# EAGLE design synth-a-phone-v1.1 (EAGLE 5.11)
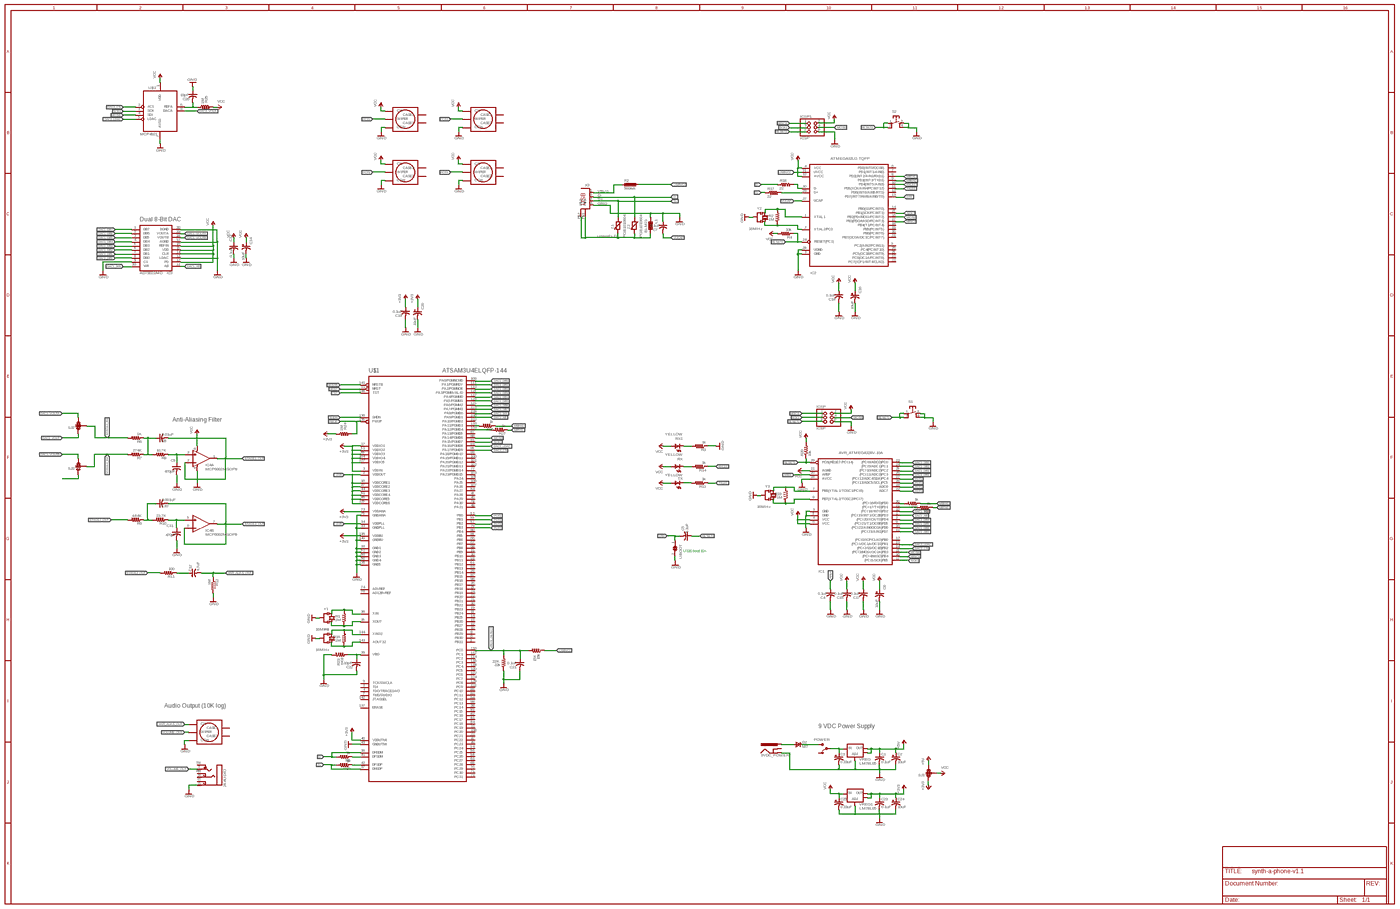
[diagram p0: schematic, sheet 1, overview]
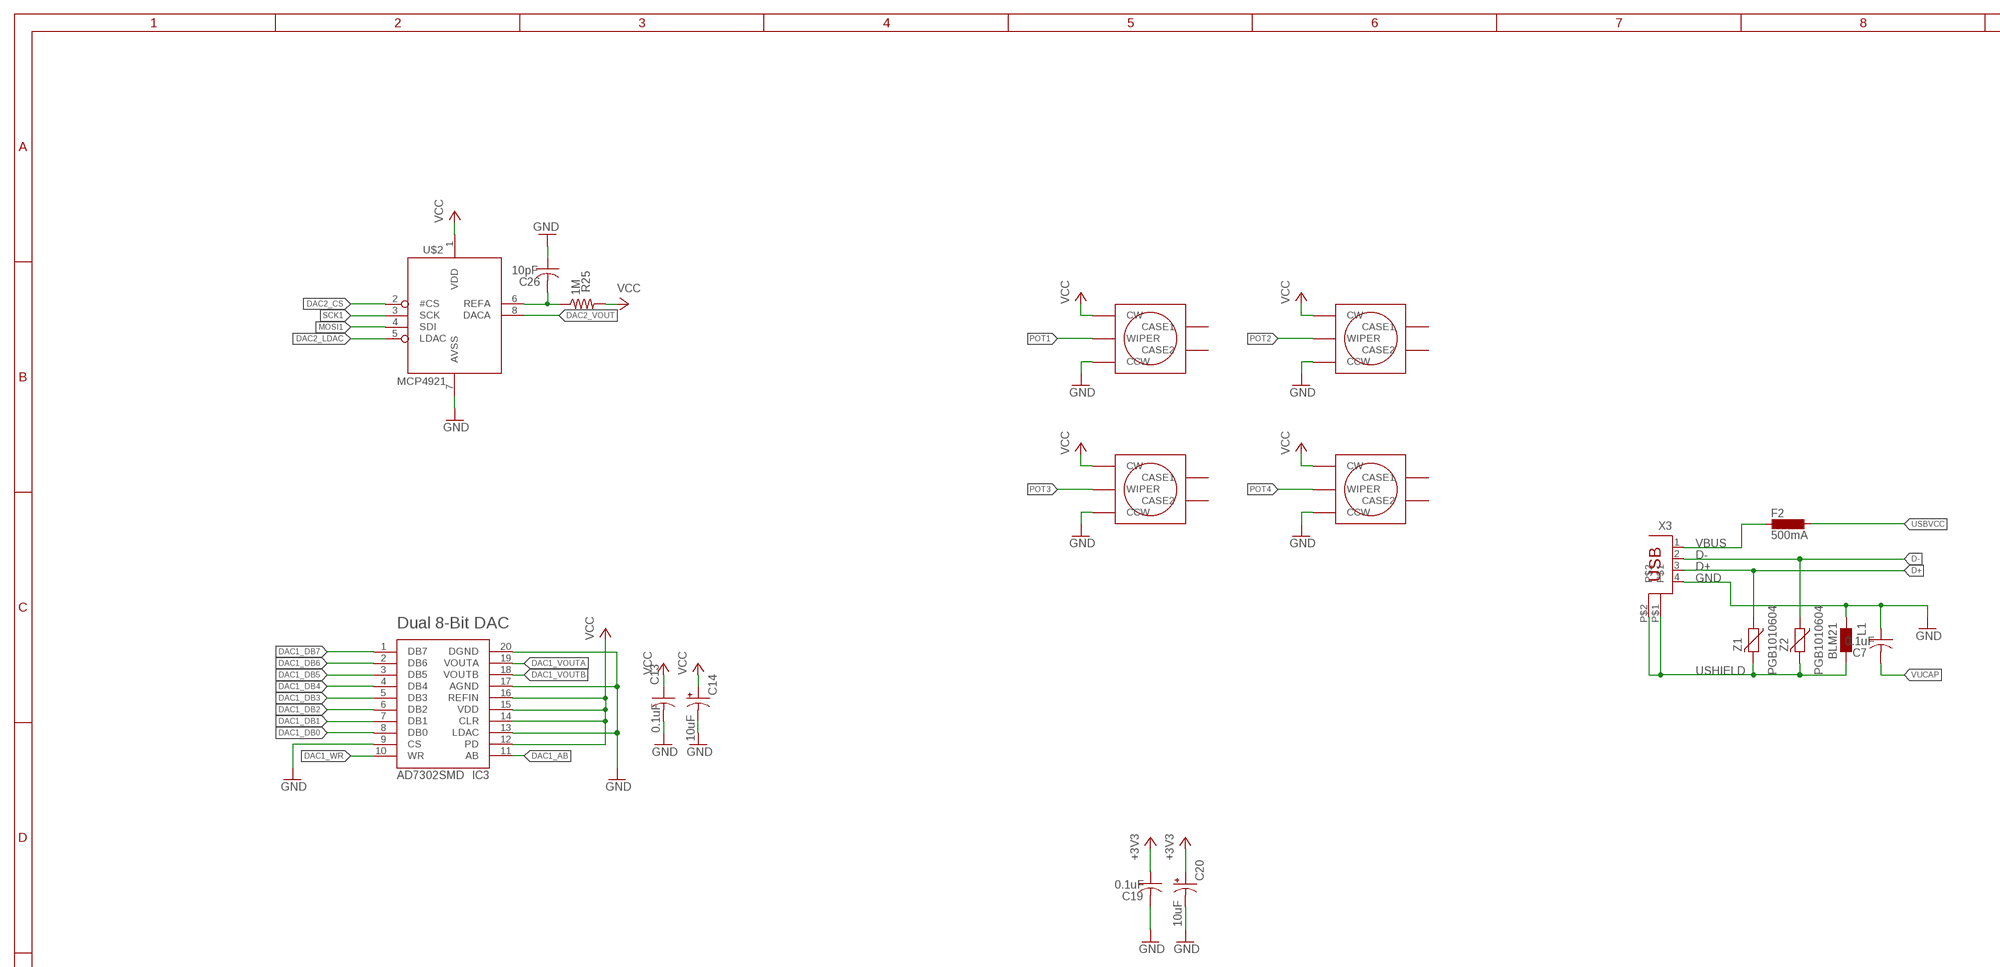
[diagram p1: schematic, sheet 1, part 1 of 4]
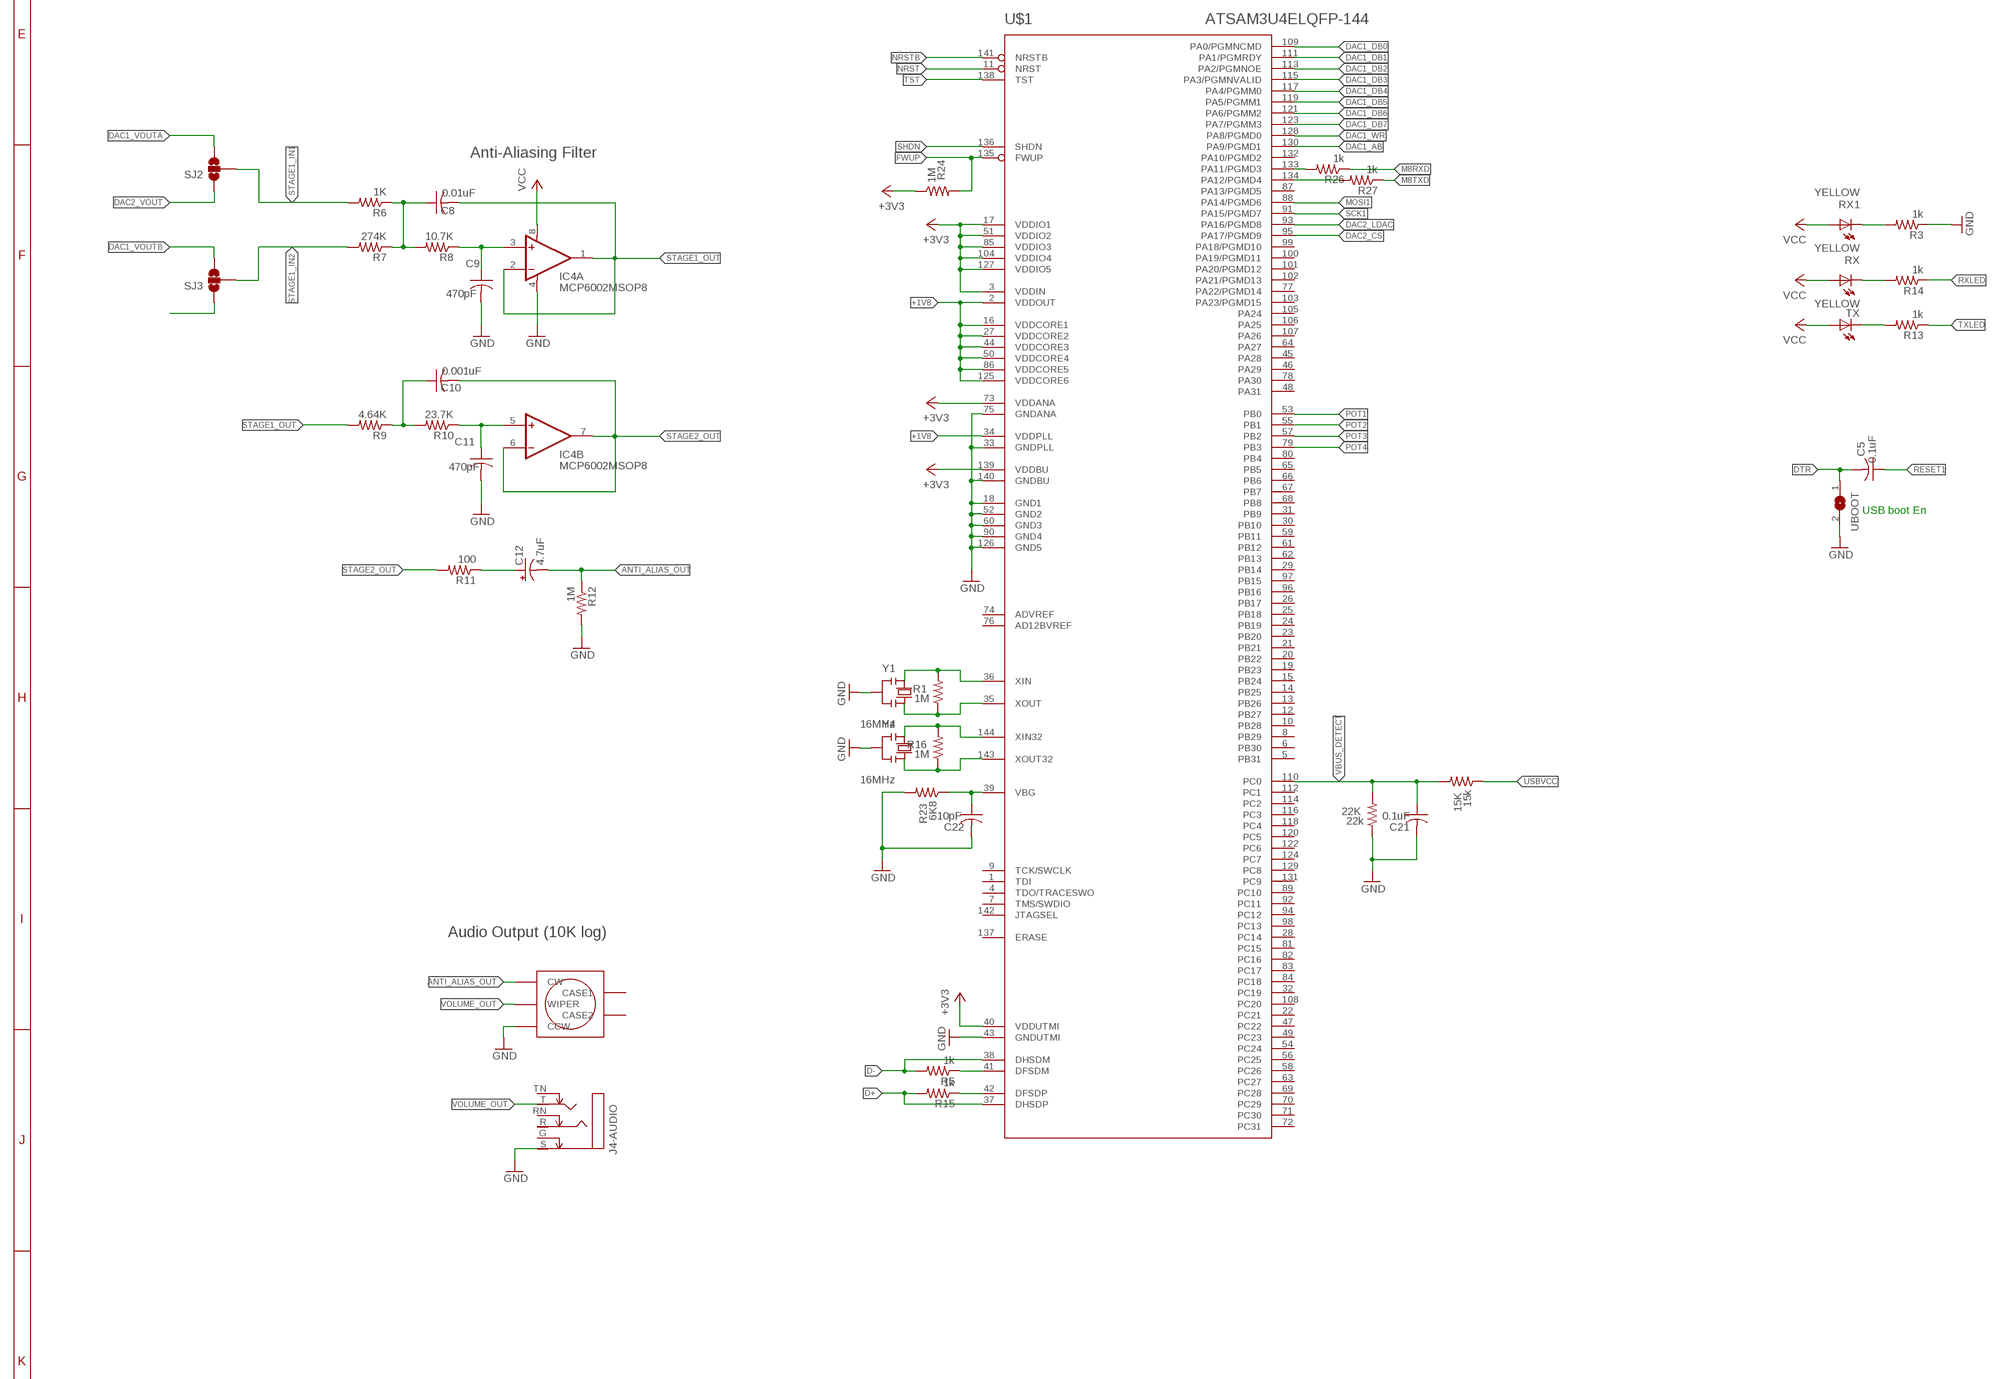
[diagram p2: schematic, sheet 1, part 2 of 4]
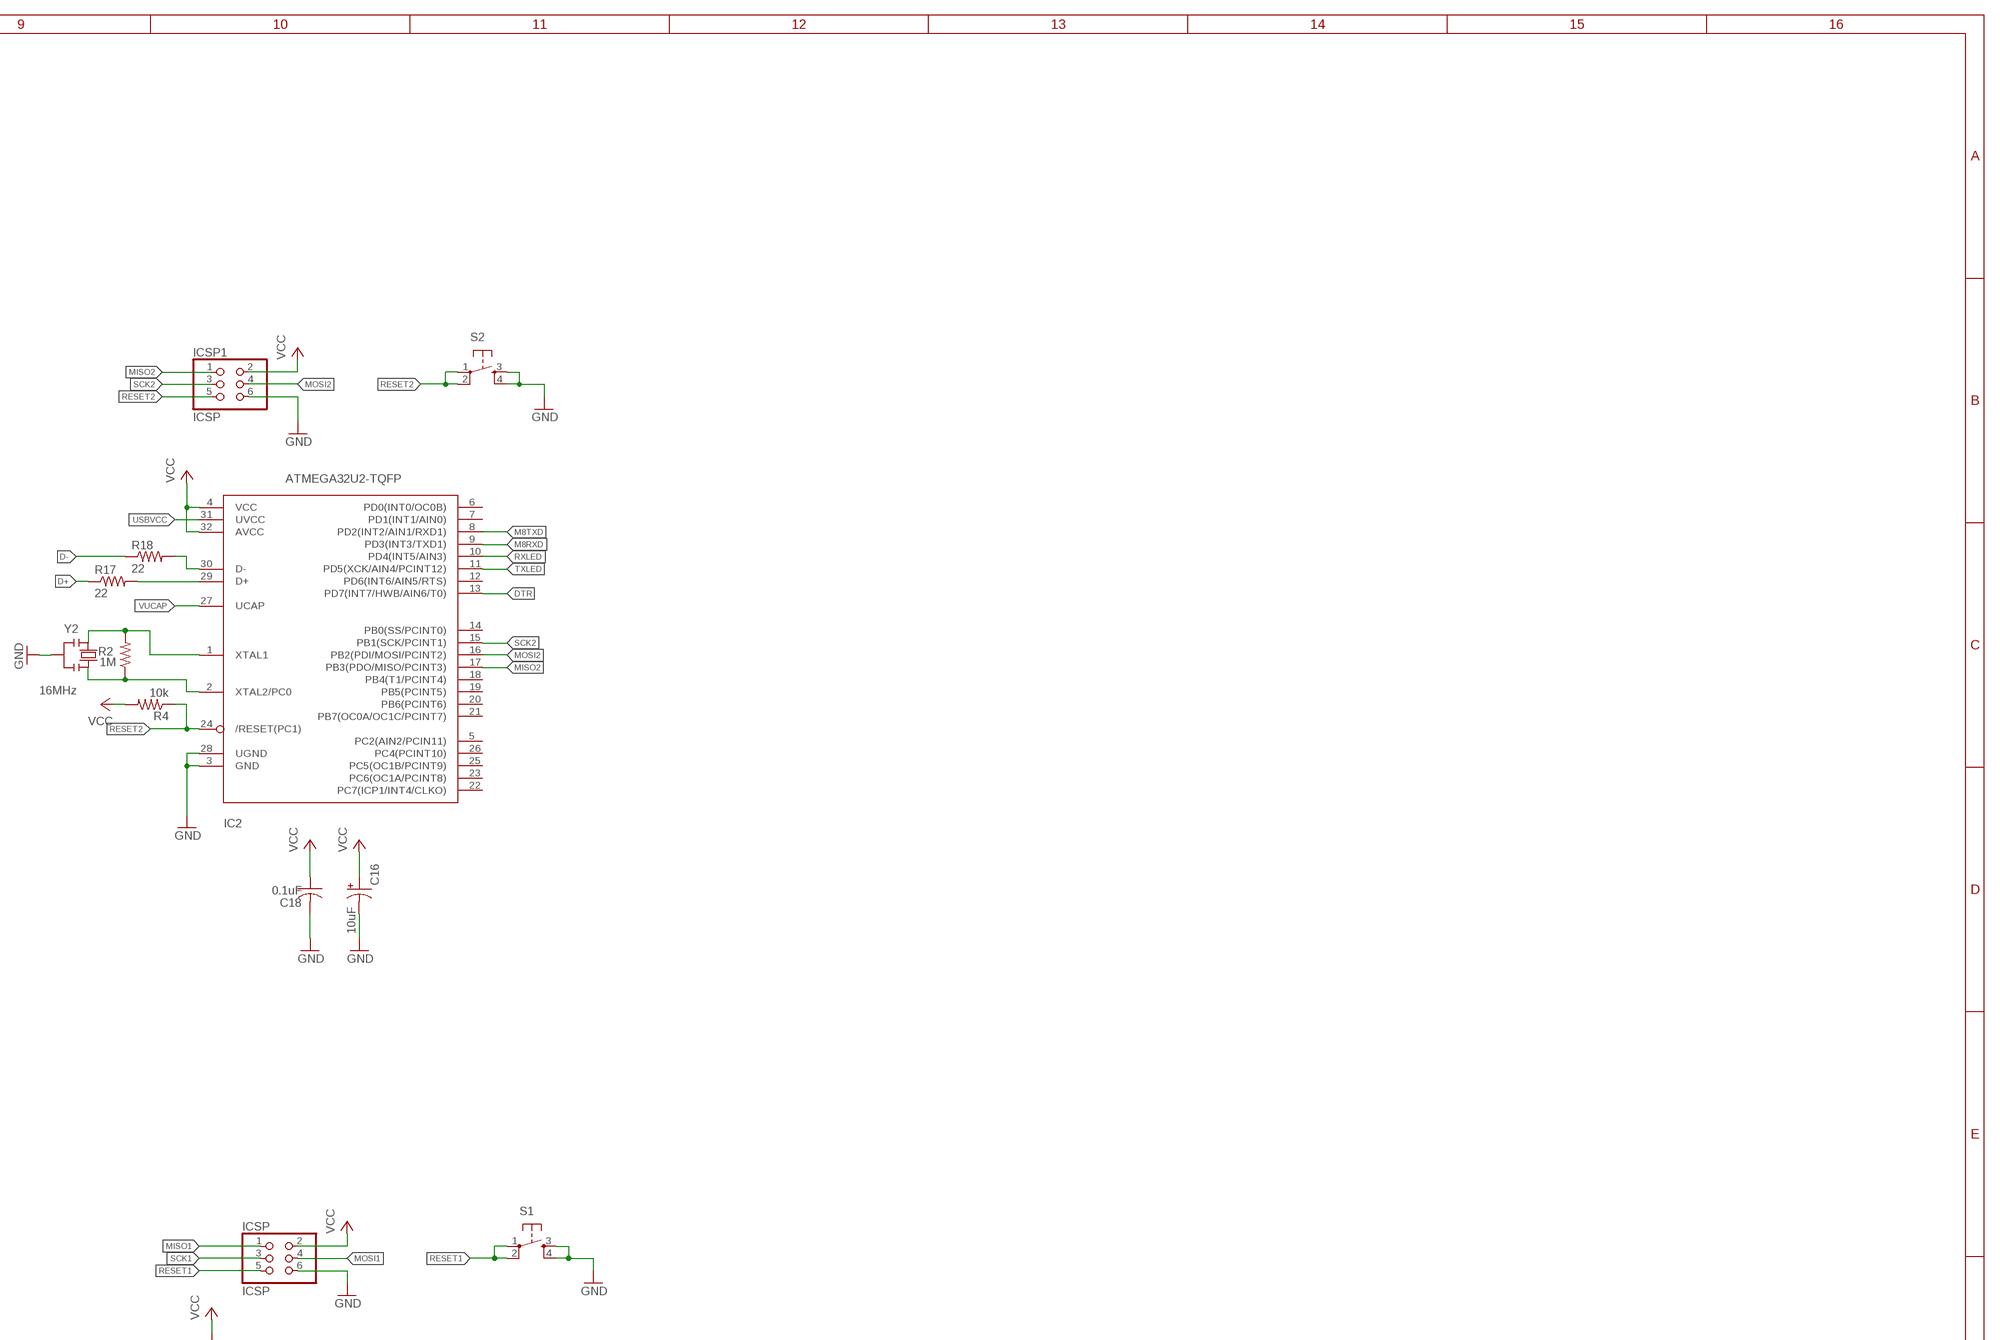
[diagram p3: schematic, sheet 1, part 3 of 4]
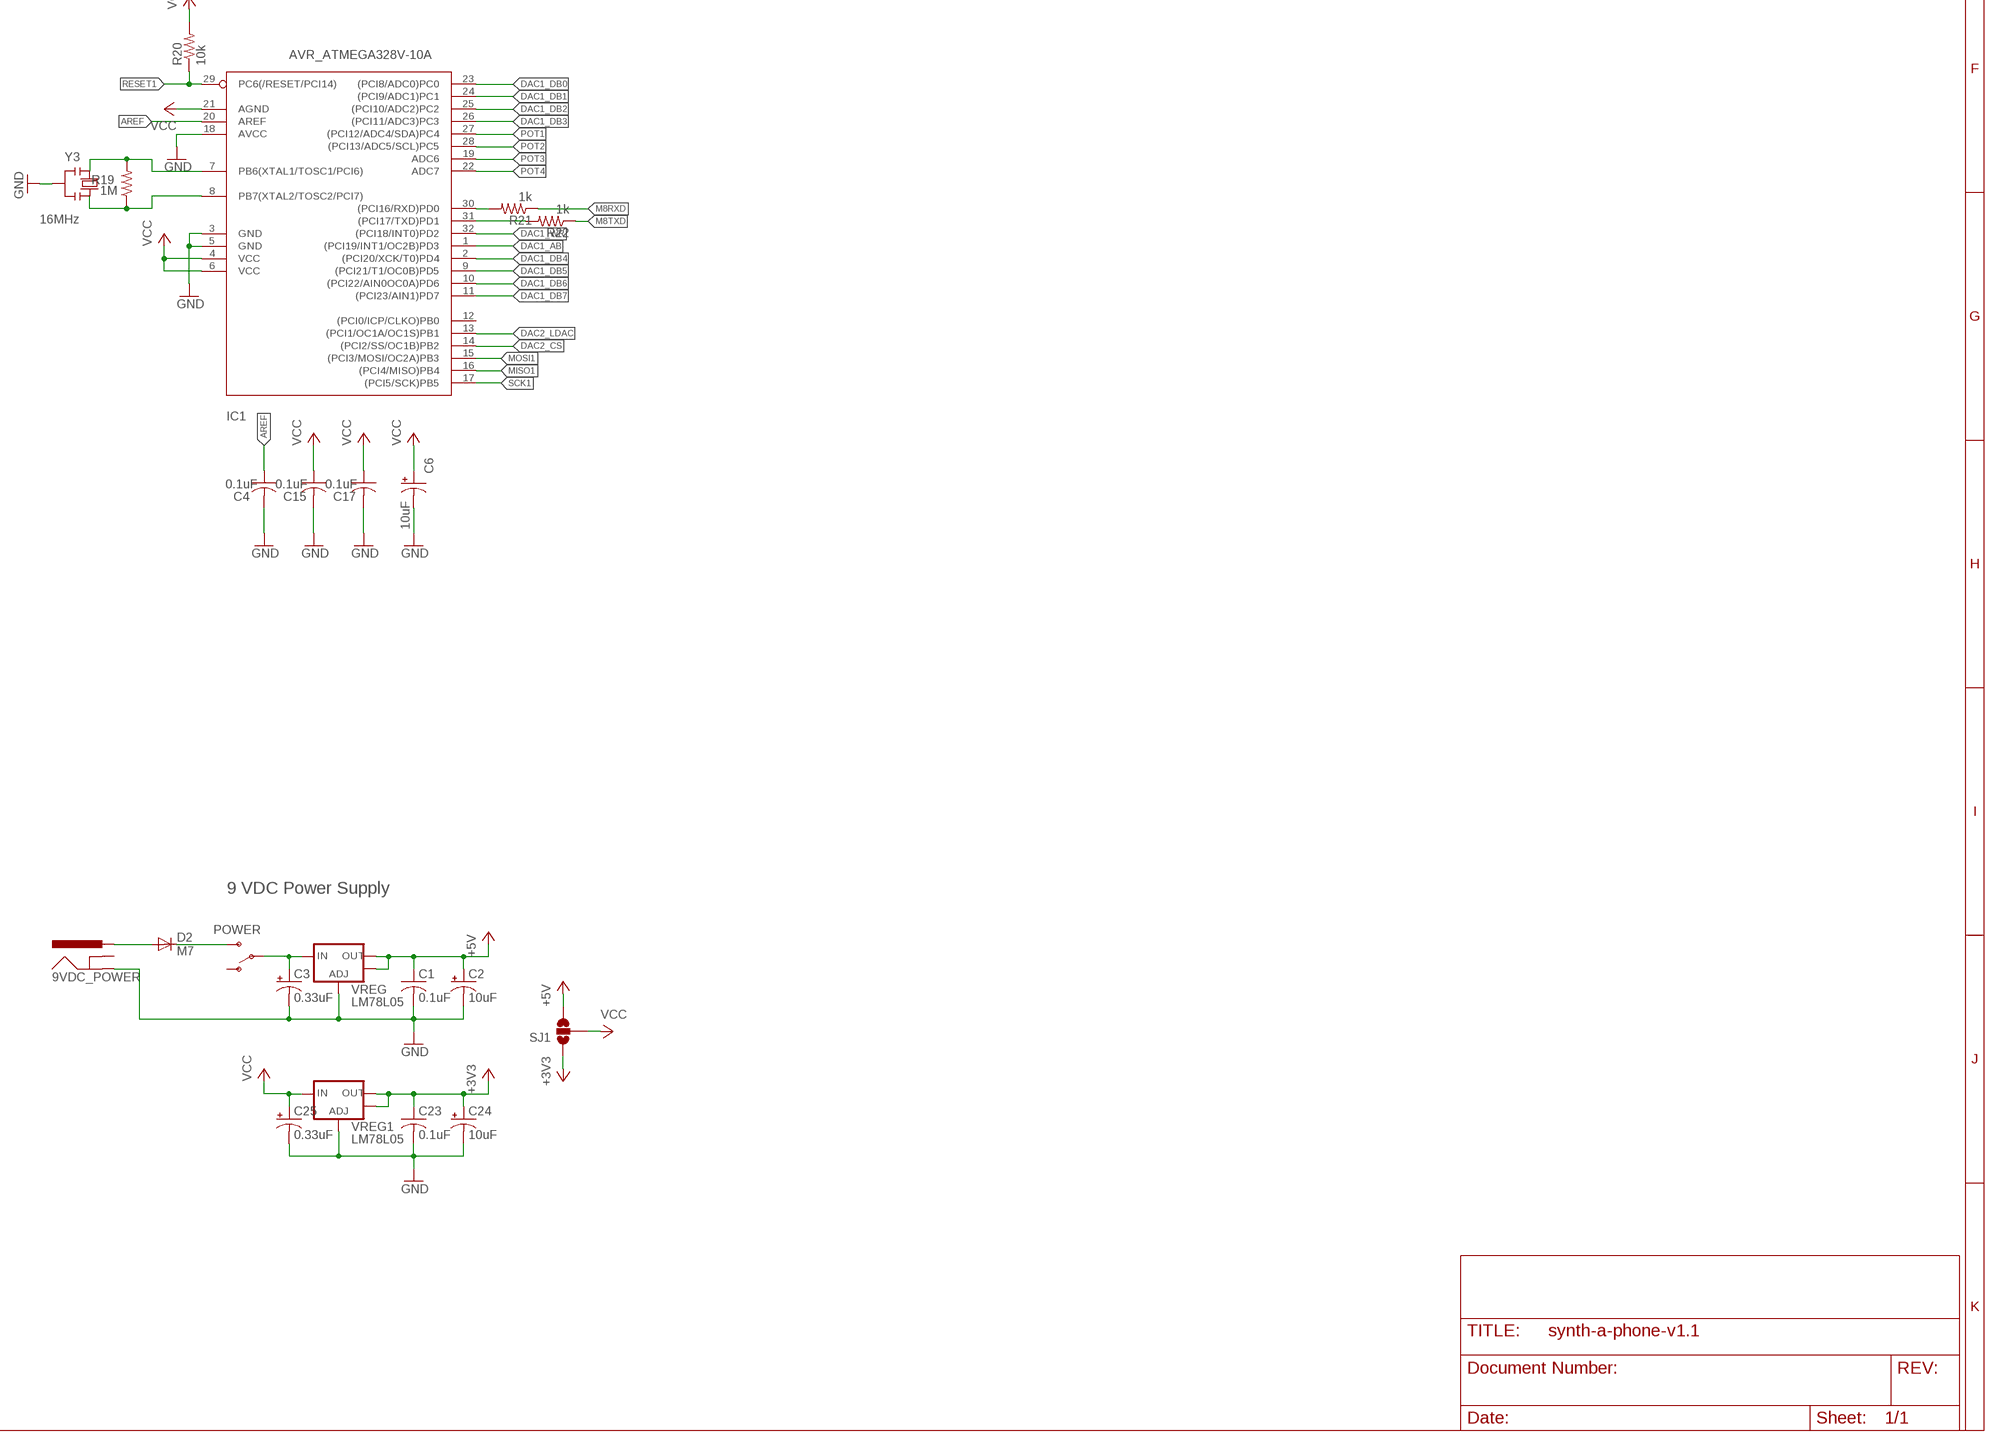
[diagram p4: schematic, sheet 1, part 4 of 4]

## Parts
9VDC_POWER  POWER_JACKPTH  [POWER_JACK_PTH]
15K  15k  R-US_R0603  [R0603]
22K  22k  R-US_R0603  [R0603]
C1  0.1uF  C-USC0603  [C0603]
C2  10uF  CPOL-USSMCA  [SMC_A]
C3  0.33uF  CPOL-USSMCA  [SMC_A]
C4  0.1uF  C-USC0603  [C0603]
C5  0.1uF  C-USC0603  [C0603]
C6  10uF  CPOL-USSMCA  [SMC_A]
C7  0.1uF  C-USC0603  [C0603]
C8  0.01uF  C-USC0603  [C0603]
C9  470pF  C-USC0603  [C0603]
C10  0.001uF  C-USC0603  [C0603]
C11  470pF  C-USC0603  [C0603]
C12  4.7uF  CPOL-USSMCA  [SMC_A]
C13  0.1uF  C-USC0603  [C0603]
C14  10uF  CPOL-USSMCA  [SMC_A]
C15  0.1uF  C-USC0603  [C0603]
C16  10uF  CPOL-USSMCA  [SMC_A]
C17  0.1uF  C-USC0603  [C0603]
C18  0.1uF  C-USC0603  [C0603]
C19  0.1uF  C-USC0603  [C0603]
C20  10uF  CPOL-USSMCA  [SMC_A]
C21  0.1uF  C-USC0603  [C0603]
C22  10pF  C-USC0603  [C0603]
C23  0.1uF  C-USC0603  [C0603]
C24  10uF  CPOL-USSMCA  [SMC_A]
C25  0.33uF  CPOL-USSMCA  [SMC_A]
C26  10pF  C-USC0603  [C0603]
D2  M7  DIODE-SMB  [SMB]
F2  500mA  L-EUL1812  [L1812]
IC1  AVR_ATMEGA328V-10A  [AVR_TQFP32-08]
IC2  ATMEGA32U2-TQFP  [TQFP32-08]
IC3  AD7302SMD  [TSSOP20]
IC4  MCP6002MSOP8  [MSOP8]
ICSP  ICSP  PINHD-2X3  [2X03]
ICSP1  ICSP  PINHD-2X3  [2X03]
J4-AUDIO  STEREOSWL  [NRJ6HF-1]
L1  BLM21  WE-CBF_0805  [0805]
POWER  SPST  SWITCH-SPSTPTH  [SWITCH-SPDT]
R1  1M  R-US_R0603  [R0603]
R2  1M  R-US_R0603  [R0603]
R3  1k  R-US_R0603  [R0603]
R4  10k  R-US_R0603  [R0603]
R5  1k  R-US_R0603  [R0603]
R6  1K  R-US_R0603  [R0603]
R7  274K  R-US_R0603  [R0603]
R8  10.7K  R-US_R0603  [R0603]
R9  4.64K  R-US_R0603  [R0603]
R10  23.7K  R-US_R0603  [R0603]
R11  100  R-US_R0603  [R0603]
R12  1M  R-US_R0603  [R0603]
R13  1k  R-US_R0603  [R0603]
R14  1k  R-US_R0603  [R0603]
R15  1k  R-US_R0603  [R0603]
R16  1M  R-US_R0603  [R0603]
R17  22  R-US_R0603  [R0603]
R18  22  R-US_R0603  [R0603]
R19  1M  R-US_R0603  [R0603]
R20  10k  R-US_R0603  [R0603]
R21  1k  R-US_R0603  [R0603]
R22  1k  R-US_R0603  [R0603]
R23  6K8  R-US_R0603  [R0603]
R24  1M  R-US_R0603  [R0603]
R25  1M  R-US_R0603  [R0603]
R26  1k  R-US_R0603  [R0603]
R27  1k  R-US_R0603  [R0603]
RX  YELLOW  LEDCHIP-LED0805  [CHIP-LED0805]
RX1  YELLOW  LEDCHIP-LED0805  [CHIP-LED0805]
S1  TAC_SWITCHPTH  [TACTILE-PTH]
S2  TAC_SWITCHPTH  [TACTILE-PTH]
SJ1  SOLDERJUMPER_2WAYS  [SJ_3]
SJ2  SOLDERJUMPER_2WAYS  [SJ_3]
SJ3  SOLDERJUMPER_2WAYS  [SJ_3]
TX  YELLOW  LEDCHIP-LED0805  [CHIP-LED0805]
U$1  ATSAM3U4ELQFP-144  [SQFP-S-20X20-144]
U$2  MCP4921MSOP8  [MSOP8]
UBOOT  SJ  [SJ]
VOLUME  Volume  VACOLOCO_EVUFRK09_POT  [VACOLOCO_EVUF]
VOLUME1  Volume  VACOLOCO_EVUFRK09_POT  [VACOLOCO_EVUF]
VOLUME2  Volume  VACOLOCO_EVUFRK09_POT  [VACOLOCO_EVUF]
VOLUME3  Volume  VACOLOCO_EVUFRK09_POT  [VACOLOCO_EVUF]
VOLUME4  Volume  VACOLOCO_EVUFRK09_POT  [VACOLOCO_EVUF]
VREG  LM78L05  V_REG_LM1117SOT223  [SOT223]
VREG1  LM78L05  V_REG_LM1117SOT223  [SOT223]
X3  PN61729  [PN61729]
Y1  16MHz  RESONATORMU  [RESONATOR]
Y2  16MHz  RESONATORMU  [RESONATOR]
Y3  16MHz  RESONATORMU  [RESONATOR]
Y4  16MHz  RESONATORMU  [RESONATOR]
Z1  PGB1010604  VARISTORCN0603  [CT/CN0603]
Z2  PGB1010604  VARISTORCN0603  [CT/CN0603]

## Nets
+1V8: U$1.2(VDDOUT) U$1.16(VDDCORE1) U$1.27(VDDCORE2) U$1.34(VDDPLL) U$1.44(VDDCORE3) U$1.50(VDDCORE4) U$1.86(VDDCORE5) U$1.125(VDDCORE6)
+3V3: C19.1 C20.+ C23.1 C24.+ R24.1 SJ1.1 U$1.3(VDDIN) U$1.17(VDDIO1) U$1.40(VDDUTMI) U$1.51(VDDIO2) U$1.73(VDDANA) U$1.85(VDDIO3) U$1.104(VDDIO4) U$1.127(VDDIO5) U$1.139(VDDBU) VREG1.2(OUT) VREG1.4(OUT)
+5V: C1.1 C2.+ SJ1.3 VREG.2(OUT) VREG.4(OUT)
ANTI_ALIAS_OUT: C12.- R12.1 VOLUME.CW
AREF: C4.1 IC1.20(AREF)
D+: R15.2 R17.1 U$1.37(DHSDP) X3.3 Z1.1
D-: R5.2 R18.1 U$1.38(DHSDM) X3.2 Z2.1
DAC1_AB: IC1.1((PCI19/INT1/OC2B)PD3) IC3.11(AB) U$1.130(PA9/PGMD1)
DAC1_DB0: IC1.23((PCI8/ADC0)PC0) IC3.8(DB0) U$1.109(PA0/PGMNCMD)
DAC1_DB1: IC1.24((PCI9/ADC1)PC1) IC3.7(DB1) U$1.111(PA1/PGMRDY)
DAC1_DB2: IC1.25((PCI10/ADC2)PC2) IC3.6(DB2) U$1.113(PA2/PGMNOE)
DAC1_DB3: IC1.26((PCI11/ADC3)PC3) IC3.5(DB3) U$1.115(PA3/PGMNVALID)
DAC1_DB4: IC1.2((PCI20/XCK/T0)PD4) IC3.4(DB4) U$1.117(PA4/PGMM0)
DAC1_DB5: IC1.9((PCI21/T1/OC0B)PD5) IC3.3(DB5) U$1.119(PA5/PGMM1)
DAC1_DB6: IC1.10((PCI22/AIN0OC0A)PD6) IC3.2(DB6) U$1.121(PA6/PGMM2)
DAC1_DB7: IC1.11((PCI23/AIN1)PD7) IC3.1(DB7) U$1.123(PA7/PGMM3)
DAC1_VOUTA: IC3.19(VOUTA) SJ2.3
DAC1_VOUTB: IC3.18(VOUTB) SJ3.3
DAC1_WR: IC1.32((PCI18/INT0)PD2) IC3.10(WR) U$1.128(PA8/PGMD0)
DAC2_CS: IC1.14((PCI2/SS/OC1B)PB2) U$1.95(PA17/PGMD9) U$2.2(#CS)
DAC2_LDAC: IC1.13((PCI1/OC1A/OC1S)PB1) U$1.93(PA16/PGMD8) U$2.5(LDAC)
DAC2_VOUT: SJ2.1 U$2.8(DACA)
DTR: C5.2 IC2.13(PD7(INT7/HWB/AIN6/T0)) UBOOT.1
FWUP: R24.2 U$1.135(FWUP)
GND: 9VDC_POWER.GND 22K.1 C1.2 C2.- C3.- C4.2 C6.- C7.1 C9.2 C11.2 C13.2 C14.- C15.2 C16.- C17.2 C18.2 C19.2 C20.- C21.2 C22.2 C23.2 C24.- C25.- C26.1 IC1.3(GND) IC1.5(GND) IC1.18(AVCC) IC2.3(GND) IC2.28(UGND) IC3.9(CS) IC3.13(LDAC) IC3.17(AGND) IC3.20(DGND) IC4.4(A:V-) ICSP1.6 ICSP.6 J4-AUDIO.S L1.1 R3.1 R12.2 R23.2 S1.3 S1.4 S2.3 S2.4 U$1.18(GND1) U$1.33(GNDPLL) U$1.43(GNDUTMI) U$1.52(GND2) U$1.60(GND3) U$1.75(GNDANA) U$1.90(GND4) U$1.126(GND5) U$1.140(GNDBU) U$2.7(AVSS) UBOOT.2 VOLUME1.CCW VOLUME2.CCW VOLUME3.CCW VOLUME4.CCW VOLUME.CCW VREG1.1(ADJ) VREG.1(ADJ) X3.4 Y1.2 Y2.2 Y3.2 Y4.2
M8RXD: IC2.9(PD3(INT3/TXD1)) R21.1 R26.1
M8TXD: IC2.8(PD2(INT2/AIN1/RXD1)) R22.1 R27.1
MISO1: IC1.16((PCI4/MISO)PB4) ICSP.1
MISO2: IC2.17(PB3(PDO/MISO/PCINT3)) ICSP1.1
MOSI1: IC1.15((PCI3/MOSI/OC2A)PB3) ICSP.4 U$1.88(PA14/PGMD6) U$2.4(SDI)
MOSI2: IC2.16(PB2(PDI/MOSI/PCINT2)) ICSP1.4
N$1: R5.1 U$1.41(DFSDM)
N$2: R15.1 U$1.42(DFSDP)
N$3: R14.2 RX.C
N$4: R13.2 TX.C
N$5: C22.1 R23.1 U$1.39(VBG)
N$6: R3.2 RX1.C
N$7: R26.2 U$1.133(PA11/PGMD3)
N$8: IC1.30((PCI16/RXD)PD0) R21.2
N$9: IC1.31((PCI17/TXD)PD1) R22.2
N$10: R27.2 U$1.134(PA12/PGMD4)
N$12: SJ3.1
N$15: C26.2 R25.1 U$2.6(REFA)
N$21: C12.+ R11.1
N$25: 9VDC_POWER.PWR D2.A
N$27: C3.+ POWER.2(P) VREG.3(IN)
N$42: D2.C POWER.3(S)
N$69: C8.1 R6.1 R7.1 R8.2
N$71: C9.1 IC4.3(A:+IN) R8.1
N$73: C10.1 R9.1 R10.2
N$74: C11.1 IC4.5(B:+IN) R10.1
NRST: U$1.11(NRST)
NRSTB: U$1.141(NRSTB)
POT1: IC1.27((PCI12/ADC4/SDA)PC4) U$1.53(PB0) VOLUME4.WIPER
POT2: IC1.28((PCI13/ADC5/SCL)PC5) U$1.55(PB1) VOLUME2.WIPER
POT3: IC1.19(ADC6) U$1.57(PB2) VOLUME3.WIPER
POT4: IC1.22(ADC7) U$1.79(PB3) VOLUME1.WIPER
RD+: IC2.29(D+) R17.2
RD-: IC2.30(D-) R18.2
RESET1: C5.1 IC1.29(PC6(/RESET/PCI14)) ICSP.5 R20.1 S1.1 S1.2
RESET2: IC2.24(/RESET(PC1)) ICSP1.5 R4.1 S2.1 S2.2
RXLED: IC2.10(PD4(INT5/AIN3)) R14.1
SCK1: IC1.17((PCI5/SCK)PB5) ICSP.3 U$1.91(PA15/PGMD7) U$2.3(SCK)
SCK2: IC2.15(PB1(SCK/PCINT1)) ICSP1.3
SHDN: U$1.136(SHDN)
STAGE1_IN1: R6.2 SJ2.2
STAGE1_IN2: R7.2 SJ3.2
STAGE1_OUT: C8.2 IC4.1(A:OUT) IC4.2(A:-IN) R9.2
STAGE2_OUT: C10.2 IC4.6(B:-IN) IC4.7(B:OUT) R11.2
TST: U$1.138(TST)
TXLED: IC2.11(PD5(XCK/AIN4/PCINT12)) R13.1
USBVCC: 15K.1 F2.1 IC2.31(UVCC)
USHIELD: L1.2 X3.P$1 X3.P$2 Z1.2 Z2.2
VBUS: F2.2 X3.1
VBUS_DETECT: 15K.2 22K.2 C21.1 U$1.110(PC0)
VCC: C6.+ C13.1 C14.+ C15.1 C16.+ C17.1 C18.1 C25.+ IC1.4(VCC) IC1.6(VCC) IC1.21(AGND) IC2.4(VCC) IC2.32(AVCC) IC3.12(PD) IC3.14(CLR) IC3.15(VDD) IC3.16(REFIN) IC4.8(A:V+) ICSP1.2 ICSP.2 R4.2 R20.2 R25.2 RX1.A RX.A SJ1.2 TX.A VOLUME1.CW VOLUME2.CW VOLUME3.CW VOLUME4.CW VREG1.3(IN)
VDD: U$2.1(VDD) ; supply symbol labelled VCC
VOLUME_OUT: J4-AUDIO.T VOLUME.WIPER
VUCAP: C7.2 IC2.27(UCAP)
XTAL1: IC2.1(XTAL1) R2.2 Y2.1
XTAL2: IC2.2(XTAL2/PC0) R2.1 Y2.3
XTAL3: R1.2 U$1.36(XIN) Y1.1
XTAL4: R1.1 U$1.35(XOUT) Y1.3
XTAL5: IC1.7(PB6(XTAL1/TOSC1/PCI6)) R19.2 Y3.1
XTAL6: IC1.8(PB7(XTAL2/TOSC2/PCI7)) R19.1 Y3.3
XTAL7: R16.2 U$1.144(XIN32) Y4.1
XTAL8: R16.1 U$1.143(XOUT32) Y4.3
Unconnected: 9VDC_POWER.GNDBREAK IC1.12((PCI0/ICP/CLKO)PB0) IC2.5(PC2(AIN2/PCIN11)) IC2.6(PD0(INT0/OC0B)) IC2.7(PD1(INT1/AIN0)) IC2.12(PD6(INT6/AIN5/RTS)) IC2.14(PB0(SS/PCINT0)) IC2.18(PB4(T1/PCINT4)) IC2.19(PB5(PCINT5)) IC2.20(PB6(PCINT6)) IC2.21(PB7(OC0A/OC1C/PCINT7)) IC2.22(PC7(ICP1/INT4/CLKO)) IC2.23(PC6(OC1A/PCINT8)) IC2.25(PC5(OC1B/PCINT9)) IC2.26(PC4(PCINT10)) J4-AUDIO.G(SN) J4-AUDIO.R J4-AUDIO.RN J4-AUDIO.TN POWER.1(O) U$1.1(TDI) U$1.4(TDO/TRACESWO) U$1.5(PB31) U$1.6(PB30) U$1.7(TMS/SWDIO) U$1.8(PB29) U$1.9(TCK/SWCLK) U$1.10(PB28) U$1.12(PB27) U$1.13(PB26) U$1.14(PB25) U$1.15(PB24) U$1.19(PB23) U$1.20(PB22) U$1.21(PB21) U$1.22(PC21) U$1.23(PB20) U$1.24(PB19) U$1.25(PB18) U$1.26(PB17) U$1.28(PC14) U$1.29(PB14) U$1.30(PB10) U$1.31(PB9) U$1.32(PC19) U$1.45(PA28) U$1.46(PA29) U$1.47(PC22) U$1.48(PA31) U$1.49(PC23) U$1.54(PC24) U$1.56(PC25) U$1.58(PC26) U$1.59(PB11) U$1.61(PB12) U$1.62(PB13) U$1.63(PC27) U$1.64(PA27) U$1.65(PB5) U$1.66(PB6) U$1.67(PB7) U$1.68(PB8) U$1.69(PC28) U$1.70(PC29) U$1.71(PC30) U$1.72(PC31) U$1.74(ADVREF) U$1.76(AD12BVREF) U$1.77(PA22/PGMD14) U$1.78(PA30) U$1.80(PB4) U$1.81(PC15) U$1.82(PC16) U$1.83(PC17) U$1.84(PC18) U$1.87(PA13/PGMD5) U$1.89(PC10) U$1.92(PC11) U$1.94(PC12) U$1.96(PB16) U$1.97(PB15) U$1.98(PC13) U$1.99(PA18/PGMD10) U$1.100(PA19/PGMD11) U$1.101(PA20/PGMD12) U$1.102(PA21/PGMD13) U$1.103(PA23/PGMD15) U$1.105(PA24) U$1.106(PA25) U$1.107(PA26) U$1.108(PC20) U$1.112(PC1) U$1.114(PC2) U$1.116(PC3) U$1.118(PC4) U$1.120(PC5) U$1.122(PC6) U$1.124(PC7) U$1.129(PC8) U$1.131(PC9) U$1.132(PA10/PGMD2) U$1.137(ERASE) U$1.142(JTAGSEL) VOLUME1.CASE1 VOLUME1.CASE2 VOLUME2.CASE1 VOLUME2.CASE2 VOLUME3.CASE1 VOLUME3.CASE2 VOLUME4.CASE1 VOLUME4.CASE2 VOLUME.CASE1 VOLUME.CASE2

## Notes on the sheet
- Dual 8-Bit DAC
- Anti-Aliasing Filter
- USB boot En
- Audio Output (10K log)
- 9 VDC Power Supply

## Library data of the parts
9VDC_POWER = meeblip:POWER_JACK: Power Jack 5.5mm barrel jack for optional 9 VDC power input.
15K 22K R1-R27 = rcl:R-US_: RESISTOR, American symbol
C1 C4 C5 C7-C11 C13 C15 C17-C19 C21-C23 C26 = rcl:C-US: CAPACITOR, American symbol
C2 C3 C6 C12 C14 C16 C20 C24 C25 = rcl:CPOL-US: POLARIZED CAPACITOR, American symbol
D2 = diode:DIODE-: DIODE
F2 = rcl:L-EU: INDUCTOR, European symbol
IC1 = avr:AVR_ATMEGA328: MICROCONTROLLER 32 kBytes FLASH 1 kBytes SRAM 512 Bytes EEPROM USART 8-channel 10 bit ADC
IC2 = adafruit:ATMEGA32U2: ATmega32u2 Pin compatible with the atmega8u2, atmega16u2 and atmega32u2 8, 16 or 32 K flash, 1K RAM, 512b EEPROM 8 bit and 16 bit timer (5 PWM total) UART, SPI (no I2C!) USB with 4 endpoints, LUFA compatible 22 I/O lines, analog comparator (no ADC!) Comes with DFU bootloader burned in!
IC3 = SparkFun:AD7302: AD7302
IC4 = Sparky:MCP6002: Dual Op Amp
ICSP ICSP1 = pinhead:PINHD-2X3: PIN HEADER
J4-AUDIO = meeblip:STEREOSW: Neutrik Stereo 1/4" Jack Easy to obtain. The mono version is used in MeeBilp, it shares the same pinout.
L1 = wuerth-elektronik:WE-CBF: SMD EMI Suppression Ferrite Beads - excellent anti-EMI properties - low DCR - impedances till 3000 ohms - rated current up to 6 A
POWER = meeblip:SWITCH-SPST: SPDT Switch ON-ON slide switch. Mouser part #102-1221-EV
RX RX1 TX = led:LED: LED OSRAM: - CHIPLED LG R971, LG N971, LY N971, LG Q971, LY Q971, LO R971, LY R971 LH N974, LH R974 LS Q976, LO Q976, LY Q976 LO Q996 - Hyper CHIPLED LW Q18S LB Q993, LB Q99A, LB R99A - SideLED LS A670, LO A670, LY A670, LG A670, LP A670 LB A673, LV A673, LT A673, LW A673 LH A674 LY A675 LS A676, LA A676, LO A676, LY A676, LW A676 LS A679, LY A679, LG A679 - Hyper Micro SIDELED® LS Y876, LA Y876, LO Y876, LY Y876 LT Y87S - SmartLED LW L88C, LW L88S LB L89C, LB L89S, LG L890 LS L89K, LO L89K, LY L89K LS L896, LA L896, LO L896, LY L896 - TOPLED LS T670, LO T670, LY T670, LG T670, LP T670 LSG T670, LSP T670, LSY T670, LOP T670, LYG T670 LG T671, LOG T671, LSG T671 LB T673, LV T673, LT T673, LW T673 LH T674 LS T676, LA T676, LO T676, LY T676, LB T676, LH T676, LSB T676, LW T676 LB T67C, LV T67C, LT T67C, LS T67K, LO T67K, LY T67K, LW E67C LS E67B, LA E67B, LO E67B, LY E67B, LB E67C, LV E67C, LT E67C LW T67C LS T679, LY T679, LG T679 LS T770, LO T770, LY T770, LG T770, LP T770 LB T773, LV T773, LT T773, LW T773 LH T774 LS E675, LA E675, LY E675, LS T675 LS T776, LA T776, LO T776, LY T776, LB T776 LHGB T686 LT T68C, LB T68C - Hyper Mini TOPLED® LB M676 - Mini TOPLED Santana® LG M470 LS M47K, LO M47K, LY M47K Source: http://www.osram.convergy.de LUXEON: - LUMILED® LXK2-PW12-R00, LXK2-PW12-S00, LXK2-PW14-U00, LXK2-PW14-V00 LXK2-PM12-R00, LXK2-PM12-S00, LXK2-PM14-U00 LXK2-PE12-Q00, LXK2-PE12-R00, LXK2-PE12-S00, LXK2-PE14-T00, LXK2-PE14-U00 LXK2-PB12-K00, LXK2-PB12-L00, LXK2-PB12-M00, LXK2-PB14-N00, LXK2-PB14-P00, LXK2-PB14-Q00 LXK2-PR12-L00, LXK2-PR12-M00, LXK2-PR14-Q00, LXK2-PR14-R00 LXK2-PD12-Q00, LXK2-PD12-R00, LXK2-PD12-S00 LXK2-PH12-R00, LXK2-PH12-S00 LXK2-PL12-P00, LXK2-PL12-Q00, LXK2-PL12-R00 Source: www.luxeon.com KINGBRIGHT: KA-3528ASYC Source: www.kingbright.com
S1 S2 = SparkFun:TAC_SWITCH: Momentary Switch Button commonly used for reset or general input. Spark Fun Electronics SKU : COM-00097
SJ1-SJ3 = SparkFun:SOLDERJUMPER_2WAY: Solder Jumper 2 way solder jumper
U$1 = Sparky:ATSAM3U4E
U$2 = Sparky:MCP4921
UBOOT = jumper:SJ: SMD solder JUMPER
VOLUME VOLUME1-VOLUME4 = meeblip:VACOLOCO_EVUF: Panasonic EVUF type potentionmeter Vertical Mount
VREG VREG1 = SparkFun:V_REG_LM1117: Voltage Regulator LM1117 Standard adjustable voltage regulator but in SMD form. Spark Fun Electronics SKU : COM-00595
X3 = SmartPrj:PN61729: BERG USB connector
Y1-Y4 = SmartPrj:RESONATOR
Z1 Z2 = varistor:VARISTOR: VARISTOR

## Board
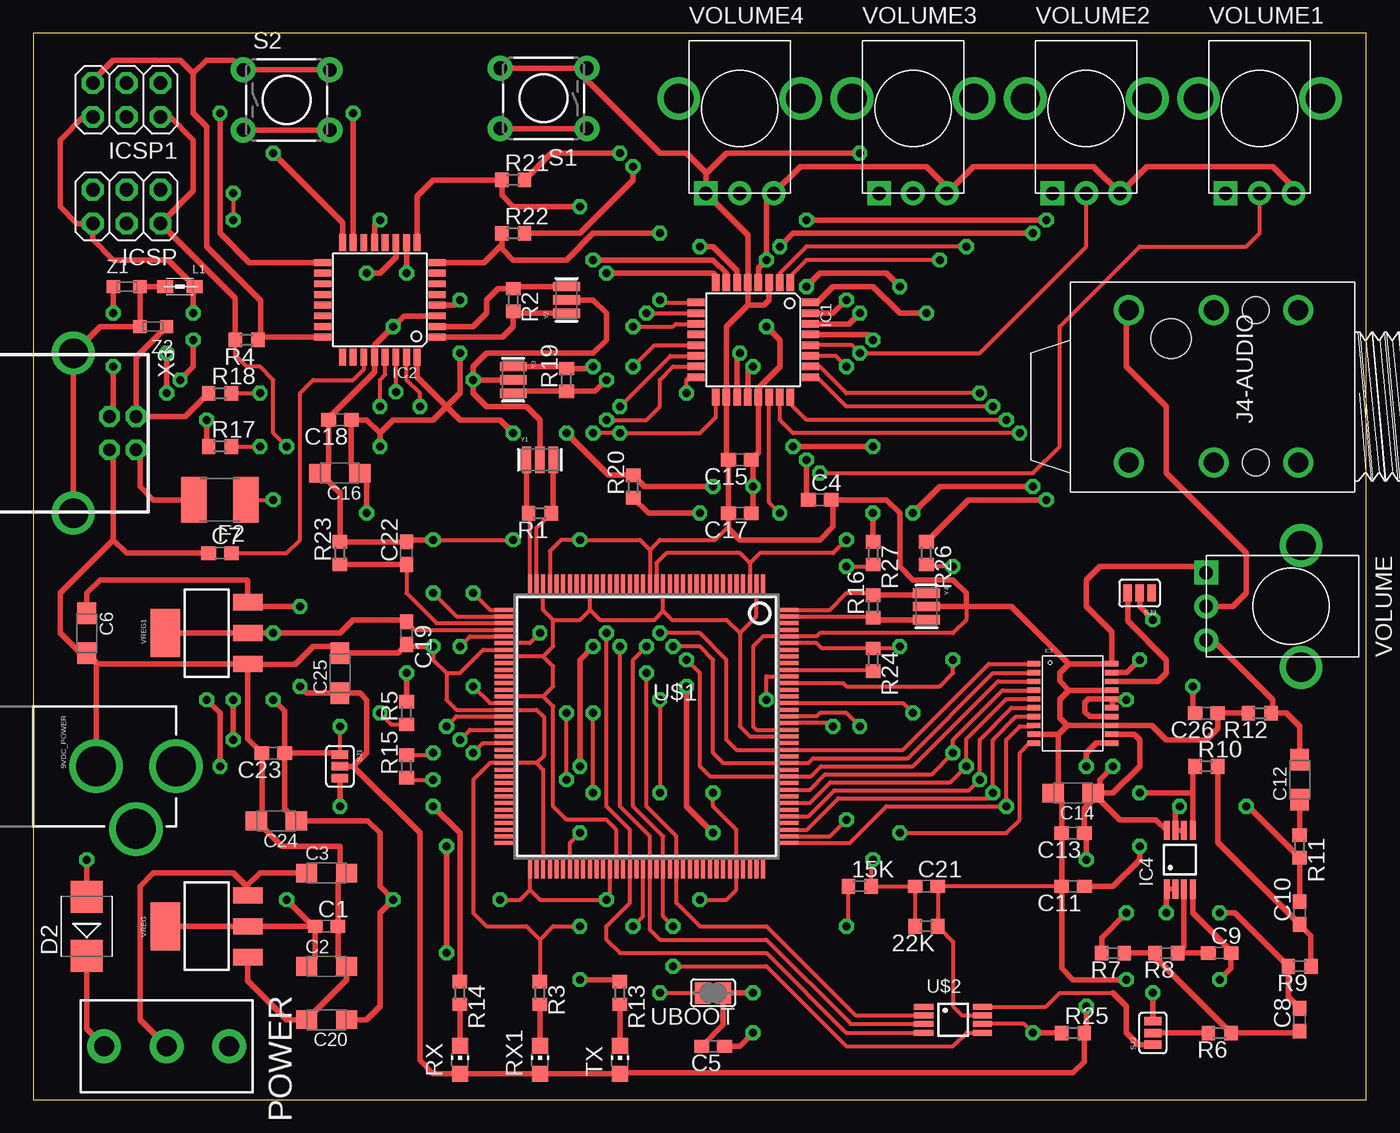
[diagram p5: board, top side]
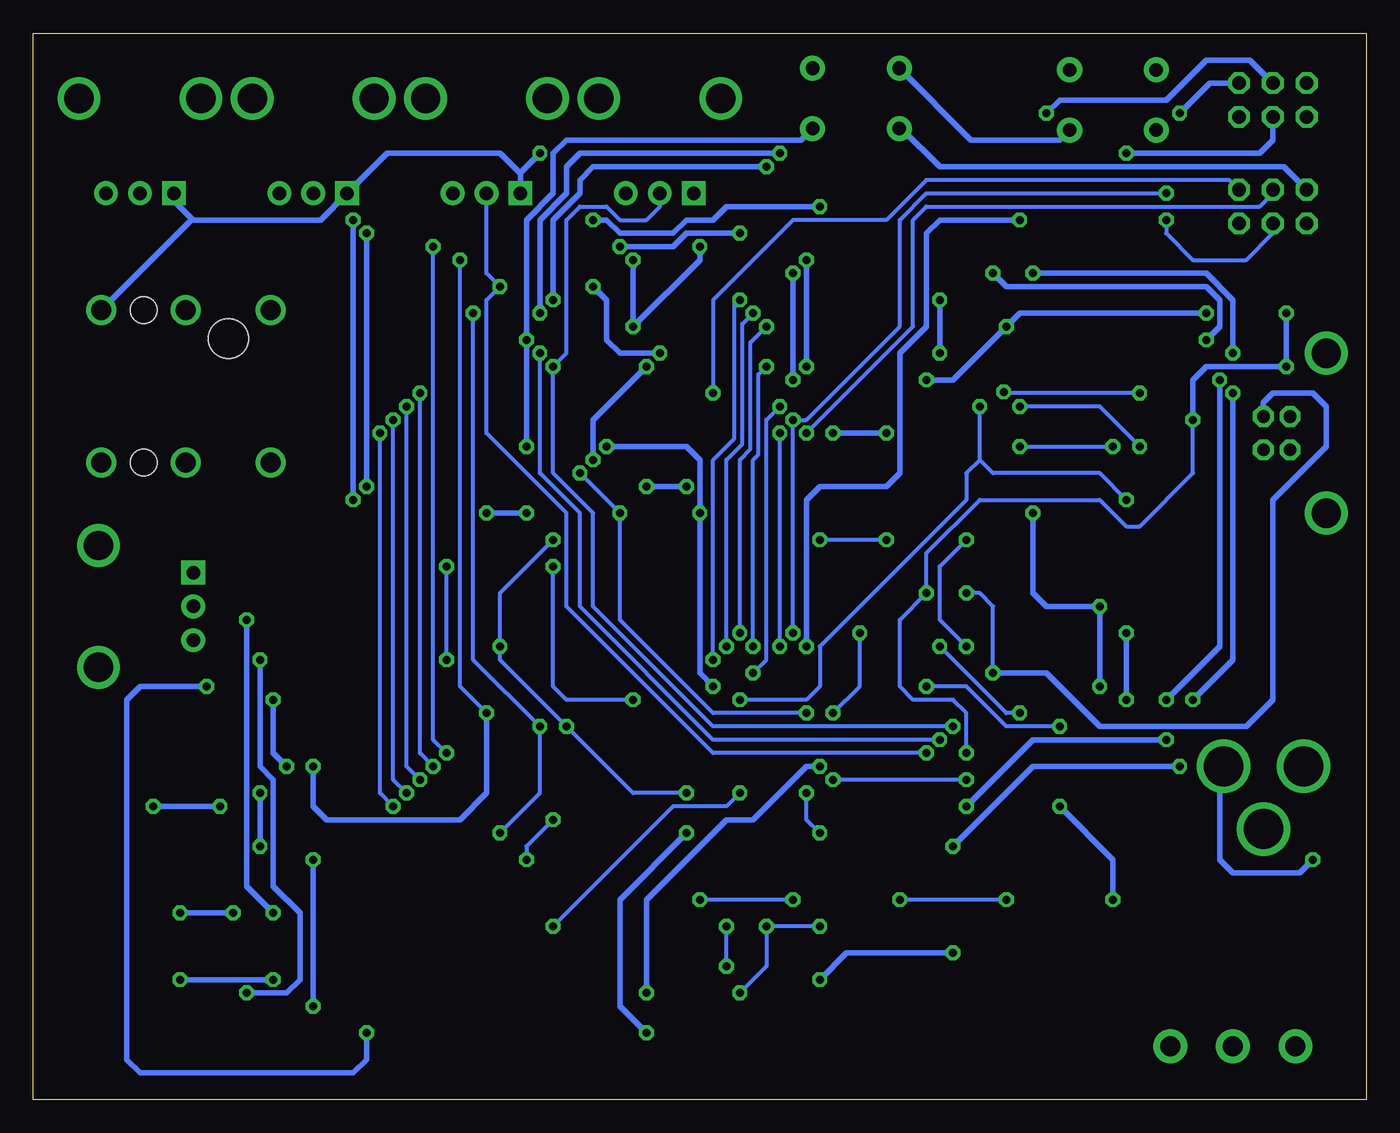
[diagram p6: board, bottom side, seen from below]

Size 100 x 80 mm. Coordinates in mm from the lower left corner, seen from the top.
Outline: 0,0 100,0 100,80 0,80 0,0
Copper layers (1*16): Top 0.035mm / dielectric 1.5mm / Bottom 0.035mm
Design rules "APC": minimum track width 7mil, minimum drill 20mil, track to track 7mil, track to pad 7mil, pad to pad 7mil, via to via 7mil, smd to smd 0mil, copper to edge 8mil, drill to drill 8mil, minimum pad ring 12mil, minimum via ring 10mil, stop-mask expansion 4mil, vias tented up to drill 25mil, thermal gap 10mil

### Footprints (pad centres in the part's own frame; a part is rotated, then mirrored left to right if it is on the bottom)
POWER_JACK_PTH = drill 2.997 round: GND 0,7.7; GNDBREAK 4.7,10.7; PWR 0,13.7
R0603 = smd 1 x 1.1: 1 -0.85,0; 2 0.85,0
C0603 = smd 1.1 x 1: 1 -0.85,0; 2 0.85,0
SMC_A = smd 1.6 x 1.4: + -1.5,0; - 1.5,0
SMB = smd 2.4 x 2.4: A 2.2,0; C -2.2,0
L1812 = smd 1.9 x 3.4: 1 -1.95,0; 2 1.95,0
AVR_TQFP32-08 = smd 1.27 x 0.559: 1 -4.293,2.8; 2 -4.293,2; 3 -4.293,1.2; 4 -4.293,0.4; 5 -4.293,-0.4; 6 -4.293,-1.2; 7 -4.293,-2; 8 -4.293,-2.8; 17 4.293,-2.8; 18 4.293,-2; 19 4.293,-1.2; 20 4.293,-0.4; 21 4.293,0.4; 22 4.293,1.2; 23 4.293,2; 24 4.293,2.8 | smd 0.559 x 1.27: 9 -2.8,-4.293; 10 -2,-4.293; 11 -1.2,-4.293; 12 -0.4,-4.293; 13 0.4,-4.293; 14 1.2,-4.293; 15 2,-4.293; 16 2.8,-4.293; 25 2.8,4.293; 26 2,4.293; 27 1.2,4.293; 28 0.4,4.293; 29 -0.4,4.293; 30 -1.2,4.293; 31 -2,4.293; 32 -2.8,4.293
TQFP32-08 = smd 1.27 x 0.508: 1 -4.293,2.8; 2 -4.293,2; 3 -4.293,1.2; 4 -4.293,0.4; 5 -4.293,-0.4; 6 -4.293,-1.2; 7 -4.293,-2; 8 -4.293,-2.8; 17 4.293,-2.8; 18 4.293,-2; 19 4.293,-1.2; 20 4.293,-0.4; 21 4.293,0.4; 22 4.293,1.2; 23 4.293,2; 24 4.293,2.8 | smd 0.508 x 1.27: 9 -2.8,-4.293; 10 -2,-4.293; 11 -1.2,-4.293; 12 -0.4,-4.293; 13 0.4,-4.293; 14 1.2,-4.293; 15 2,-4.293; 16 2.8,-4.293; 25 2.8,4.293; 26 2,4.293; 27 1.2,4.293; 28 0.4,4.293; 29 -0.4,4.293; 30 -1.2,4.293; 31 -2,4.293; 32 -2.8,4.293
TSSOP20 = smd 1 x 0.4: 1 -2.937,2.693; 2 -2.937,2.032; 3 -2.937,1.372; 4 -2.937,0.712; 5 -2.937,0.051; 6 -2.937,-0.609; 7 -2.937,-1.27; 8 -2.943,-1.93; 9 -2.937,-2.59; 10 -2.937,-3.251; 11 2.905,-3.251; 12 2.905,-2.59; 13 2.911,-1.93; 14 2.905,-1.27; 15 2.905,-0.609; 16 2.905,0.051; 17 2.905,0.712; 18 2.905,1.372; 19 2.905,2.032; 20 2.905,2.693
MSOP8 = smd 1.45 x 0.45: 1 -2.2,0.975; 2 -2.2,0.325; 3 -2.2,-0.325; 4 -2.2,-0.975; 5 2.2,-0.975; 6 2.2,-0.325; 7 2.2,0.325; 8 2.2,0.975
2X03 = drill 1.016 octagon: 1 -2.54,-1.27; 2 -2.54,1.27; 3 0,-1.27; 4 0,1.27; 5 2.54,-1.27; 6 2.54,1.27
NRJ6HF-1 = drill 1.5 round: G -4.2,-5.91; R 7.23,0.44; RN -4.2,0.44; S 7.23,-5.91; T 7.23,6.79; TN -4.2,6.79 | hole 2: 7.23,-2.71; -4.2,-2.71 | hole 3: 5.1,3.64
0805 = smd 1.2 x 1: 1 -1.1,0; 2 1.1,0
SWITCH-SPDT = drill 1.5 pad 2.54 round: 1 0,4.699; 2 0,0; 3 0,-4.699
CHIP-LED0805 = smd 1.2 x 1.2: A 0,-1.05; C 0,1.05
TACTILE-PTH = drill 1.016 pad 1.88 round: 1 -3.251,2.261; 2 3.251,2.261; 3 -3.251,-2.261; 4 3.251,-2.261
SJ_3 = smd 0.635 x 1.27: 1 -0.889,0; 2 0,0; 3 0.889,0
SQFP-S-20X20-144 = smd 0.3 x 1.6: 1 -8.75,-10.6; 2 -8.25,-10.6; 3 -7.75,-10.6; 4 -7.25,-10.6; 5 -6.75,-10.6; 6 -6.25,-10.6; 7 -5.75,-10.6; 8 -5.25,-10.6; 9 -4.75,-10.6; 10 -4.25,-10.6; 11 -3.75,-10.6; 12 -3.25,-10.6; 13 -2.75,-10.6; 14 -2.25,-10.6; 15 -1.75,-10.6; 16 -1.25,-10.6; 17 -0.75,-10.6; 18 -0.25,-10.6; 19 0.25,-10.6; 20 0.75,-10.6; 21 1.25,-10.6; 22 1.75,-10.6; 23 2.25,-10.6; 24 2.75,-10.6; 25 3.25,-10.6; 26 3.75,-10.6; 27 4.25,-10.6; 28 4.75,-10.6; 29 5.25,-10.6; 30 5.75,-10.6; 31 6.25,-10.6; 32 6.75,-10.6; 33 7.25,-10.6; 34 7.75,-10.6; 35 8.25,-10.6; 36 8.75,-10.6; 73 8.75,10.6; 74 8.25,10.6; 75 7.75,10.6; 76 7.25,10.6; 77 6.75,10.6; 78 6.25,10.6; 79 5.75,10.6; 80 5.25,10.6; 81 4.75,10.6; 82 4.25,10.6; 83 3.75,10.6; 84 3.25,10.6; 85 2.75,10.6; 86 2.25,10.6; 87 1.75,10.6; 88 1.25,10.6; 89 0.75,10.6; 90 0.25,10.6; 91 -0.25,10.6; 92 -0.75,10.6; 93 -1.25,10.6; 94 -1.75,10.6; 95 -2.25,10.6; 96 -2.75,10.6; 97 -3.25,10.6; 98 -3.75,10.6; 99 -4.25,10.6; 100 -4.75,10.6; 101 -5.25,10.6; 102 -5.75,10.6; 103 -6.25,10.6; 104 -6.75,10.6; 105 -7.25,10.6; 106 -7.75,10.6; 107 -8.25,10.6; 108 -8.75,10.6 | smd 1.6 x 0.3: 37 10.6,-8.75; 38 10.6,-8.25; 39 10.6,-7.75; 40 10.6,-7.25; 41 10.6,-6.75; 42 10.6,-6.25; 43 10.6,-5.75; 44 10.6,-5.25; 45 10.6,-4.75; 46 10.6,-4.25; 47 10.6,-3.75; 48 10.6,-3.25; 49 10.6,-2.75; 50 10.6,-2.25; 51 10.6,-1.75; 52 10.6,-1.25; 53 10.6,-0.75; 54 10.6,-0.25; 55 10.6,0.25; 56 10.6,0.75; 57 10.6,1.25; 58 10.6,1.75; 59 10.6,2.25; 60 10.6,2.75; 61 10.6,3.25; 62 10.6,3.75; 63 10.6,4.25; 64 10.6,4.75; 65 10.6,5.25; 66 10.6,5.75; 67 10.6,6.25; 68 10.6,6.75; 69 10.6,7.25; 70 10.6,7.75; 71 10.6,8.25; 72 10.6,8.75; 109 -10.6,8.75; 110 -10.6,8.25; 111 -10.6,7.75; 112 -10.6,7.25; 113 -10.6,6.75; 114 -10.6,6.25; 115 -10.6,5.75; 116 -10.6,5.25; 117 -10.6,4.75; 118 -10.6,4.25; 119 -10.6,3.75; 120 -10.6,3.25; 121 -10.6,2.75; 122 -10.6,2.25; 123 -10.6,1.75; 124 -10.6,1.25; 125 -10.6,0.75; 126 -10.6,0.25; 127 -10.6,-0.25; 128 -10.6,-0.75; 129 -10.6,-1.25; 130 -10.6,-1.75; 131 -10.6,-2.25; 132 -10.6,-2.75; 133 -10.6,-3.25; 134 -10.6,-3.75; 135 -10.6,-4.25; 136 -10.6,-4.75; 137 -10.6,-5.25; 138 -10.6,-5.75; 139 -10.6,-6.25; 140 -10.6,-6.75; 141 -10.6,-7.25; 142 -10.6,-7.75; 143 -10.6,-8.25; 144 -10.6,-8.75
SJ = smd 1.168 x 1.6: 1 -0.762,0; 2 0.762,0
VACOLOCO_EVUF = drill 2.2 round: CASE1 -4.572,7.112; CASE2 4.572,7.112 | drill 1.016 pad 1.778 square: CCW -2.54,0 | drill 1.016 pad 1.778 round: CW 2.54,0; WIPER 0,0
SOT223 = smd 1.219 x 2.235: 1 -2.311,-3.099; 2 0,-3.099; 3 2.311,-3.099 | smd 3.6 x 2.2: 4 0,3.099
PN61729 = drill 0.95 octagon: 1 1.25,4.71; 2 -1.25,4.71; 3 -1.25,2.71; 4 1.25,2.71 | drill 2.2 round: P$1 -6,0; P$2 6,0
RESONATOR = smd 0.7 x 2: 1 -1,0; 2 0,0; 3 1,0
CT/CN0603 = smd 1 x 1: 1 -1,0; 2 1,0

### Placement (x,y rotation side)
9VDC_POWER  -3,25 270 top
15K  62,16 0 top
22K  67,13 180 top
C1  22,13 0 top
C2  22,10 0 top
C3  22,17 0 top
C4  59,45 0 top
C5  51,4 180 top
C6  4,35 270 top
C7  14,41 0 top
C8  95,6 90 top
C9  89,11 0 top
C10  95,14 90 top
C11  78,16 180 top
C12  95,24 90 top
C13  78,20 180 top
C14  78,23 180 top
C15  53,48 180 top
C16  23,47 180 top
C17  53,44 180 top
C18  23,51 180 top
C19  28,35 270 top
C20  22,6 180 top
C21  67,16 0 top
C22  28,41 90 top
C23  18,26 180 top
C24  18.24,20.91 180 top
C25  23,32 90 top
C26  88,29 180 top
D2  4,13 90 top
F2  14,45 180 top
IC1  54,57 270 top
IC2  26,60 180 top
IC3  78,30 0 top
IC4  86,18 90 top
ICSP  7,67 180 top
ICSP1  7,75 180 top
J4-AUDIO  89,52 90 top
L1  11,61 180 top
POWER  10,4 270 top
R1  38,44 180 top
R2  36,60 270 top
R3  38,8 270 top
R4  16,57 180 top
R5  28,29 90 top
R6  89,5 180 top
R7  81,11 180 top
R8  85,11 180 top
R9  95,10 180 top
R10  88,25 0 top
R11  95,19 270 top
R12  92,29 180 top
R13  44,8 270 top
R14  32,8 270 top
R15  28,25 90 top
R16  63,37 90 top
R17  14,49 0 top
R18  14,53 0 top
R19  40,54 90 top
R20  45,46 90 top
R21  36,69 0 top
R22  36,65 0 top
R23  23,41 90 top
R24  63,33 270 top
R25  78,5 0 top
R26  67,41 270 top
R27  63,41 270 top
RX  32,3 0 top
RX1  38,3 0 top
S1  38.28,75.12 180 top
S2  19,75 0 top
SJ1  23,25 270 top
SJ2  84,5 90 top
SJ3  83,38 180 top
TX  44,3 0 top
U$1  46,28 180 top
U$2  69,6 0 top
UBOOT  51,8 180 top
VOLUME  88,37 270 top
VOLUME1  92,68 0 top
VOLUME2  79,68 0 top
VOLUME3  66,68 0 top
VOLUME4  53,68 0 top
VREG  13,13 90 top
VREG1  13,35 90 top
X3  3,50 270 top
Y1  38,48 0 top
Y2  40,60 90 top
Y3  36,54 270 top
Y4  67,37 270 top
Z1  7,61 0 top
Z2  9,58 180 top

### Tracks (layer width: path | path; a pad name or v marks a point on that pad's centre or on a via)
+1V8
  Top 0.305: U$1.34 38.25,36.75 39,36 | 39,36 41,36 41.75,36.75 | 41.75,36.75 U$1.27 | 41.75,36.75 42.5,36 46.6,36 47.25,36.65 | 47.25,36.65 U$1.16 | 47.25,36.65 47.9,36 52,36 53,35 | U$1.86 43.75,20.25 43,21 40,21 39,22 39,29.5 38.25,30.25 | 38.25,30.25 U$1.50 | 38.25,33.25 U$1.44 | 38.25,33.25 39,34 39,36 | 38.25,33.25 39,32.5 39,31 38.25,30.25 | U$1.125 53.75,27.25 53,28 53,35 | 53,35 54.25,36.25 U$1.2
+3V3  (via drill 0.6)
  Top 0.305: U$1.139 58.75,34.25 59.15,33.85 R24.1 64.85,33.85 v65,34 | 53.75,40.25 53,41 47.5,41 46.75,40.25 U$1.17 | 53.75,40.25 U$1.3 | U$1.40 28.6,35.25 C19.1 | 53.75,40.25 54.5,41 60,41 v61,42 | v50,15 52,15 52.75,15.75 U$1.104 52.75,20.25 51,22 v51,23 | 37.25,15.75 38,15 v43,15 43.25,15.25 U$1.85 | 37.25,15.75 U$1.73 | 37.25,15.75 36.5,15 v35,15 | U$1.51 34.25,29.75 v33,31 | SJ1.1 v23,28 | U$1.127 59.75,28.25 v60,28
  Top 0.406: C20.+ 25,6 26,7 26,14 v27,15 26,16 26,20 25.09,20.91 C24.+ 18.85,21.8 C23.1 | VREG1.4 VREG1.2 v18,35 23,35 24,36 27.85,36 C19.1 | v18,30 18.85,29.15 C23.1 | SJ1.1 22.89,26 C23.1
  Bottom 0.305: v61,42 65,38 v65,34 65,33 v60,28 55,23 v51,23 | v43,15 v50,15 | v27,15 v35,15 | v33,31 30,31 27,28 v23,28
  Bottom 0.406: v18,30 v18,35
+5V  (via drill 0.6)
  Top 0.406: VREG.4 VREG.2 C1.1 | C2.+ 21.15,10.65 C1.1 | C1.1 21,13 v19,15 | v23,22 SJ1.3
  Bottom 0.406: v19,15 19,18 v23,22
ANTI_ALIAS_OUT
  Top 0.406: C12.- 95,28 94,29 R12.1 93,29.15 93,30 88.54,34.46 VOLUME.CW
AREF  (via drill 0.6)
  Top 0.406: IC1.20 53.6,54.6 v54,55 | v58,48 58,45.15 C4.1
  Bottom 0.406: v54,55 58,51 v58,48
D+  (via drill 0.6)
  Top 0.305: U$1.37 34.25,36.75 v33,38 | v30,26 29.85,25.85 R15.2
  Top 0.406: v13,51 13,49.15 R17.1 | X3.3 6,51.54 v6,55 | v6,59 Z1.1
  Bottom 0.305: v30,26 30,29 31,30 34,30 35,31 35,36 v33,38 33,41 29,45 20,45 18,43 17,43 13,47 v13,51
  Bottom 0.406: v6,59 v6,55 12,55 13,54 v13,51
D-  (via drill 0.6)
  Top 0.305: U$1.38 31.75,36.25 v30,38
  Top 0.406: v28,32 R5.2 | R18.1 11.4,51.25 X3.2 7.71,55.71 Z2.1
  Bottom 0.305: v30,38 29,38 28,37 v28,32
  Bottom 0.406: v28,32 24,32 20,28 9,28 7,30 7,45 3,49 3,52 4,53 7,53 7.71,52.29 X3.2
DAC1_AB  (via drill 0.6)
  Top 0.305: U$1.130 65.25,29.75 v66,29 | IC1.1 56.8,61.8 58,63 v68,63
  Top 0.406: IC3.11 79.75,26.75 79,26 v79,25
  Bottom 0.305: v66,29 68,31 v68,63
  Bottom 0.406: v66,29 66,23 68,21 78,21 79,22 v79,25
DAC1_DB0  (via drill 0.6)
  Top 0.305: U$1.109 61.25,19.25 64,22 v73,22 73,27 74,28 74.99,28 IC3.8 | IC1.23 56,51 57,50 v74,50
  Bottom 0.305: v73,22 74,23 v74,50
DAC1_DB1  (via drill 0.6)
  Top 0.305: U$1.111 58.05,20.25 60.4,22.6 71.6,22.6 v72,23 72,27 73.73,28.73 IC3.7 | IC1.24 56.8,52.2 58,51 v73,51
  Bottom 0.305: v72,23 73,24 v73,51
DAC1_DB2  (via drill 0.6)
  Top 0.305: U$1.113 58.15,21.25 60.1,23.2 70.2,23.2 v71,24 71,27 73.39,29.39 IC3.6 | IC1.25 58.8,54.2 61,52 v72,52
  Bottom 0.305: v71,24 72,25 v72,52
DAC1_DB3  (via drill 0.6)
  Top 0.305: IC3.5 73,30.05 70,27.05 v70,25 68.8,23.8 59.8,23.8 58.25,22.25 U$1.115 | IC1.26 59,55 61,53 v71,53
  Bottom 0.305: v70,25 71,26 v71,53
DAC1_DB4  (via drill 0.6)
  Top 0.305: U$1.117 58.25,23.25 59.4,24.4 67.4,24.4 v69,26 69,27 72.71,30.71 IC3.4 | v70,64 58,64 56,62 IC1.2
  Bottom 0.305: v69,26 70,27 v70,64
DAC1_DB5  (via drill 0.6)
  Top 0.305: IC3.3 72.37,31.37 66,25 59.1,25 58.35,24.25 U$1.119 50.75,24.25 50,25 50,32 v49,33 | v47,60 47.2,59.8 IC1.9
  Bottom 0.305: v49,33 49,48 47.4,49.6 47.4,59.6 v47,60
DAC1_DB6  (via drill 0.6)
  Top 0.305: IC3.2 75.03,32 72,32 65.6,25.6 58.5,25.6 58.15,25.25 U$1.121 51.75,25.25 51,26 51,33 50,34 v48,34 | v46,59 IC1.10
  Bottom 0.305: v48,34 48,48 46.8,49.2 46.8,58.2 v46,59
DAC1_DB7  (via drill 0.6)
  Top 0.305: IC3.1 71.69,32.69 65.25,26.25 U$1.123 52.75,26.25 52,27 52,33 50,35 v47,35 | IC1.11 48.2,58.2 48,58 v45,58
  Bottom 0.305: v47,35 47,48 46.2,48.8 46.2,56.8 v45,58
DAC1_VOUTA  (via drill 0.6)
  Top 0.406: IC3.19 82.03,32.03 v83,33 | v84,8 SJ2.3
  Bottom 0.406: v83,33 83,25 82,24 82,16 80,14 80,9 81,8 v84,8
DAC1_VOUTB
  Top 0.406: IC3.18 84.37,31.37 85,32 85,33 82.11,35.89 SJ3.3
DAC1_WR  (via drill 0.6)
  Top 0.305: IC3.10 74.75,26.75 74,26 74,21 73,20 v65,20 | U$1.128 58.75,28.75 59,29 61,29 v62,28
  Top 0.406: IC1.32 58.8,59.8 60,61 63,61 65,59 v67,59
  Bottom 0.305: v65,20 62,23 v62,28 67,33 v67,59
DAC2_CS  (via drill 0.6)
  Top 0.305: U$2.2 61.67,6.33 55,13 50,13 48.25,14.75 U$1.95 48.25,19.75 46,22 v46,32 | IC1.14 47.8,55.8 v44,52
  Bottom 0.305: v46,32 45,33 45,51 v44,52
DAC2_LDAC  (via drill 0.6)
  Top 0.305: v48,10 55,10 61,4 69,4 70.03,5.03 U$2.5 | v48,13 47.25,13.75 U$1.93 47.25,19.75 45,22 45,33 v46,34 | v45,55 46.6,56.6 IC1.13
  Bottom 0.305: v48,10 v48,13 | v46,34 46,48 45.6,48.4 45.6,54.4 v45,55
DAC2_VOUT
  Top 0.305: U$2.8 75.97,6.97 77,8 81,8
  Top 0.406: SJ2.1 82.89,4.11 82,5 82,7 81,8
DTR  (via drill 0.6)
  Top 0.406: C5.2 51.76,5.61 UBOOT.1 v54,8 | IC2.13 25.6,65.6 v26,66 | v41,25 41,33 v42,34
  Bottom 0.406: v54,8 54,15 48,21 46,21 42,25 v41,25 | v42,34 42,45 41,46 36,46 35,47 35,56 33,58 33,65 32,66 v26,66
FWUP
  Top 0.305: R24.2 62.9,32.25 U$1.135
GND  (via drill 0.6)
  Top 0.305: C11.2 C21.2 22K.1 69,11.85 69,7 69.67,6.33 U$2.7 | 70,37 70,36 69,35 59,35 58.75,34.75 U$1.140 54.75,34.75 54,34 54,28 54.25,27.75 U$1.126 | 46.25,41.25 U$1.18 | 46.25,41.25 47,42 51.15,42 52.15,43 | U$1.33 38.75,41.15 39.6,42 v41,42 45.5,42 46.25,41.25 | U$1.75 38.25,24.75 37.75,25.25 | 37.75,25.25 U$1.60 34.25,25.25 33,24 33,14 34,13 37,13 38,12 | 37.75,25.25 38.3,25.8 38.3,28.7 37.75,29.25 U$1.52 31.75,29.25 31,30 31,32 | U$1.43 33.75,33.75 32,32 31,32 | v47,8 UBOOT.2 | v45,13 45.75,13.75 U$1.90 | 38,12 R3.1 | 38,12 39,13 v41,13 | v30,34 30,33 31,32 | v30,42 v36,42
  Top 0.406: VREG.1 16.1,8.9 19,6 C20.- 23.5,9 C2.- 22.85,10.65 C1.2 22.85,16.35 23,16.5 | 23,16.5 C3.- | 23,16.5 23,19 18.65,19 C24.- 17.15,21.32 C23.2 16.1,27.05 VREG1.1 | 4.7,32.8 9VDC_POWER.GND | 4.7,32.8 C6.- 3.5,33.5 2,35 2,38 6,42 | VREG1.1 16.15,32.64 19.64,32.64 21,34 22.5,34 C25.- 27.35,33.5 C19.2 28.15,34 v30,34 | C7.1 7,41 6,42 | 6,42 6,48.46 X3.4 | C22.2 R23.2 23,45.5 C16.- 22.15,47.65 C18.2 22.15,51.15 25.6,54.6 IC2.28 25.6,56.6 v27,58 27.8,58.8 IC2.3 | C22.2 28,42 | C22.2 28.15,42 v30,42 | IC4.4 87,15.78 87,14 89.85,11.15 C9.2 89.85,9.85 v89,9 | IC3.20 80.91,35.09 79,37 79,39 80,40 87.54,40 VOLUME.CCW | IC3.20 79.39,32.69 | 76.91,27.41 IC3.9 | 76.91,27.41 76.91,23.41 C14.- 77.15,22.35 C13.2 C11.2 77.15,9.85 78,9 v82,9 | R12.2 C26.1 88.85,27.85 88,27 85,27 83.93,28.07 IC3.13 77.57,28.07 | 77.57,28.07 76.91,27.41 | 77.69,32.69 IC3.20 | 77.69,32.69 77,32 77,31.4 77.69,30.71 | 77.69,30.71 IC3.17 | 77.69,30.71 77,30.02 77,28.64 77.57,28.07 | 70,37 73.39,37 77.69,32.69 | 70,37 Y4.2 | 70,37 70,38 69,39 66,39 65,40 65,44 64,45 C4.2 60,44.85 60,43 59,42 53,42 52.15,42.85 52.15,43 C17.2 C15.2 52,48.15 IC1.18 52,58 53.6,59.6 | 53.6,59.6 IC1.5 53.6,64.86 VOLUME4.CCW 50.46,69.46 | IC1.3 55.2,60 54.8,59.6 53.6,59.6 | v33,54 Y3.2 | Y2.2 42,60 43,59 43,57 42,56 34,56 33,55 v33,54 | v33,54 33,53 34,52 37,52 38,51 Y1.2 | v12,59 12,60.9 L1.1 10.1,63 6,63 4.46,64.54 ICSP.6 3.27,65.73 2,67 2,72 3.73,73.73 ICSP1.6 | 50.46,69.46 52,71 v62,71 | 50.46,69.46 50.46,69.54 49,71 47,71 41.53,76.47 S1.3 S1.4 | S2.4 S2.3 | VREG1.1 4.81,32.69 4.7,32.8
  Bottom 0.305: v47,8 45,10 v45,13 v41,13 | v36,42 v41,42 | v30,34 32,36 32,40 v30,42
  Bottom 0.406: v82,9 v89,9 | v33,54 31,54 v27,58 26,59 v12,59 | 88,66 78.46,66 VOLUME2.CCW 73.46,71 65,71 63.46,69.46 | 88,66 89.46,67.46 VOLUME1.CCW | J4-AUDIO.S 88.14,66 88,66 | S2.4 22.99,72 29.65,72 S1.4 | v62,71 63.46,69.54 63.46,69.46 | 63.46,69.46 VOLUME3.CCW
M8RXD  (via drill 0.6)
  Top 0.406: IC2.9 28.8,67.8 30,69 R21.1 35.15,67.85 36,67 v41,67 | R26.1 70.15,45 v76,45 | v58,66 v76,66
  Bottom 0.406: v76,66 v76,45 | v58,66 57,66 56,65 52,65 51,66 49,66 48,67 v41,67
M8TXD  (via drill 0.6)
  Top 0.406: IC2.8 33.8,62.8 35.15,64.15 R22.1 35.15,63.85 36,63 40,63 42,65 v47,65 | v63,44 R27.1 | v66,44 68,46 v75,46 | v75,65 57,65 v56,64
  Bottom 0.406: v66,44 v63,44 | v75,65 v75,46 | v56,64 52,64 51,65 v47,65
MISO1  (via drill 0.6)
  Top 0.305: IC1.16 49.2,54.2 49,54 v49,53
  Bottom 0.305: v49,53 49,60 43,66 36,66 33,69 10.27,69 ICSP.1
MISO2  (via drill 0.6)
  Top 0.406: IC2.17 16.2,62.8 14,65 v14,74
  Bottom 0.406: v14,74 11.73,76.27 ICSP1.1
MOSI1  (via drill 0.6)
  Top 0.305: U$2.4 60.98,5.03 55,11 44,11 43,12 43,13 44.75,14.75 U$1.88 44.75,20.25 43,22 v43,35 | IC1.15 48,55 47,54 47,52 46,51 v43,51 | v15,68 v15,66
  Bottom 0.305: v43,35 v43,51 42,51 35,58 35,66 33,68 v15,68 | v15,66 15,65 13,63 9,63 7,65 ICSP.4
MOSI2  (via drill 0.6)
  Top 0.406: IC2.16 23.2,65.8 v18,71
  Bottom 0.406: ICSP1.4 7,72 8,71 v18,71
N$1  (via drill 0.6)
  Top 0.305: U$1.41 32.75,34.75 v32,34 | R5.1 26.85,28.15 v26,29
  Bottom 0.305: v32,34 27,29 v26,29
N$2  (via drill 0.6)
  Top 0.305: U$1.42 37.25,34.25 v38,35 | v40,24 v40,29 | v30,24 28.15,24 R15.1
  Bottom 0.305: v30,24 v40,24 | v40,29 38,31 v38,35
N$3
  Top 0.406: RX.C R14.2
N$4
  Top 0.406: TX.C R13.2
N$5
  Top 0.305: U$1.39 30.25,35.75 28,38 C22.1
  Top 0.406: R23.1 C22.1
N$6
  Top 0.406: RX1.C R3.2
N$7  (via drill 0.6)
  Top 0.305: U$1.133 60.75,31.25 61,31 68,31 69,32 v69,33 | v69,40 67.15,40 R26.2
  Bottom 0.305: v69,33 v69,40
N$8  (via drill 0.6)
  Top 0.406: IC1.30 61.2,58.2 v62,59 | v44,71 38.85,71 R21.2
  Bottom 0.406: v44,71 59,71 60,70 60,68 62,66 v62,59
N$9  (via drill 0.6)
  Top 0.406: IC1.31 60,59 v61,60 | R22.2 41,65 45,69 v45,70
  Bottom 0.406: v45,70 58,70 59,69 59,68 61,66 v61,60
N$10  (via drill 0.6)
  Top 0.305: R27.2 62.85,40 v61,40 | v55,30 55,31.75 U$1.134
  Bottom 0.305: v61,40 61,31 60,30 v55,30
N$15  (via drill 0.6)
  Top 0.305: U$2.6 74.33,5.67 v75,5
  Top 0.406: C26.2 87,29.15 v87,31 | v75,5 R25.1
  Bottom 0.406: v87,31 92,31 93,30 93,3 92,2 76,2 75,3 v75,5
N$21
  Top 0.406: R11.1 C12.+
N$25  (via drill 0.6)
  Top 0.406: D2.A v4,18
  Bottom 0.406: v4,18 5,17 10,17 11,18 11,24.7 9VDC_POWER.PWR
N$27
  Top 0.406: POWER.2 8,6 8,16 9,17 15,17 16.1,15.9 VREG.3 16.1,16.1 17,17 C3.+
N$42
  Top 0.406: POWER.3 4,5.3 D2.C
N$69
  Top 0.406: R7.1 R8.2 84.15,10.7 R6.1 94.85,5 C8.1
N$71
  Top 0.406: C9.1 R8.1 86.33,11.47 IC4.3
N$73
  Top 0.406: R9.1 95.85,12.3 C10.1 88.85,19.3 R10.2
N$74  (via drill 0.6)
  Top 0.406: 86.97,23 IC4.5 | 86.97,23 86.97,24.82 R10.1 | v83,19 83,18 81,16 C11.1 | v83,23 86.97,23
  Bottom 0.406: v83,19 v83,23
POT1  (via drill 0.6)
  Top 0.305: U$1.53 31.75,28.75 v31,28 | v61,55 60.2,55.8 IC1.27
  Bottom 0.305: v31,28 49,28 58,37 58,44 61,47 v61,55 60,56 60,66 59,67 57,67 56,66 54,66 53,67 VOLUME4.WIPER
POT2  (via drill 0.6)
  Top 0.305: IC1.28 61.4,56.6 v62,56 71,56 79,64 VOLUME2.WIPER | U$1.55 32.75,27.75 v32,27
  Bottom 0.305: v32,27 49,27 59,37 59,44 62,47 v62,56
POT3  (via drill 0.6)
  Top 0.305: U$1.57 33.75,26.75 v33,26
  Top 0.406: IC1.19 52.8,55.8 v53,56 | v58,61 59,62 64,62 v65,61
  Bottom 0.305: v33,26 49,26 60,37 60,44 66,50 66,60 v65,61 66,62 VOLUME3.WIPER
  Bottom 0.406: v53,56 56,56 57,57 57,60 v58,61
POT4  (via drill 0.6)
  Top 0.305: IC1.22 55.2,44.8 v56,44 | v42,23 v42,29 | v41,20 40.25,19.25 U$1.79 | v59,47 75,47 77,49 77,58 83,64 91,64 92,65 VOLUME1.WIPER
  Bottom 0.305: v42,29 49,29 56,36 v56,44 v59,47 | v42,23 42,21 v41,20
RD+  (via drill 0.6)
  Top 0.305: R17.2 v17,49 | IC2.29 26.4,54.4 26,54 v26,52
  Bottom 0.305: v26,52 20,52 v17,49
RD-  (via drill 0.6)
  Top 0.305: v27.2,53.1 IC2.30 | R18.2 v17,53
  Bottom 0.305: v17,53 27.1,53 v27.2,53.1
RESET1  (via drill 0.6)
  Top 0.406: v50,44 46.15,44 R20.1 | 59,57.4 IC1.29 62.6,57.4 v63,57 | v49,31 49,22 v51,20 | v54,5 53,4 C5.1 | v57,49 v63,49 | S1.1 S1.2
  Bottom 0.406: v49,31 50,32 v50,44 50,48 51,49 v57,49 | v63,49 v63,57 63,66 61,68 61,71 60,72 42.39,72 S1.1 | ICSP.5 6.19,70 32,70 34.86,72.86 S1.2 | v54,5 56,7 56,15 v51,20
RESET2
  Top 0.406: R4.1 17.05,57.2 | 17.05,57.2 IC2.24 | S2.2 S2.1 15.01,78 13,78 12,77 | ICSP1.5 4.46,76.46 6,78 11,78 12,77 | 17.05,57.2 17.05,59.95 13,64 13,73 12,74 12,77
RXLED  (via drill 0.6)
  Top 0.406: R14.1 32,20 v30,22 | v28,62 IC2.10 | v15,27 v15,30 | v12,57 12,55 v11,54
  Bottom 0.406: v30,22 25,27 v15,27 | v28,62 27,61 12,61 11,60 11,58 v12,57 | v15,30 11,34 v11,54
SCK1  (via drill 0.6)
  Top 0.305: U$2.3 61.33,5.67 55,12 47,12 46.25,12.75 U$1.91 46.25,19.75 44,22 v44,34 | IC1.17 51.2,51.2 50,50 v44,50 v42,50
  Bottom 0.305: v44,34 v44,50 | v42,50 34,58 34,66 33,67 8,67 7,68 ICSP.3
SCK2  (via drill 0.6)
  Top 0.406: v24,74 IC2.15
  Bottom 0.406: ICSP1.3 8.73,78 12,78 15,75 23,75 v24,74
STAGE1_IN1
  Top 0.406: SJ2.2 R6.2
STAGE1_IN2  (via drill 0.6)
  Top 0.406: R7.2 80.15,12.15 v82,14 | SJ3.2 83,37 v84,36
  Bottom 0.406: v82,14 84,16 v84,36
STAGE1_OUT  (via drill 0.6)
  Top 0.406: IC4.2 IC4.1 85,15.78 v85,14 | v89,14 90.15,14 R9.2 94.15,7.7 C8.2
  Bottom 0.406: v85,14 v89,14
STAGE2_OUT  (via drill 0.6)
  Top 0.406: C10.2 R11.2 91.15,22 v91,22 | v86,22 85.67,21.68 IC4.7 IC4.6
  Bottom 0.406: v86,22 v91,22
TXLED  (via drill 0.6)
  Top 0.406: R13.1 43.85,9 v41,9 | v31,19 v31,11 | v14,25 14,29 v13,30 | v25,62 26,62 27.2,63.2 IC2.11 | v10,53 v10,56
  Bottom 0.406: v41,9 39,11 v31,11 | v31,19 25,25 v14,25 | v13,30 10,33 v10,53 | v25,62 12,62 10,60 v10,56
USBVCC  (via drill 0.6)
  Top 0.305: F2.1 v18,45 | v47,30 v47,23 | v61,13 61.15,13.15 15K.1 | IC2.31 28,54 29,53 v29,52
  Bottom 0.305: v18,45 20,47 28,47 29,48 | v47,23 48,22 52,22 v61,13 | v47,30 42,30 41,31 41,34 30,45 30,47 29,48 | 29,48 v29,52
USHIELD
  Top 0.406: L1.2 Z1.2 Z2.2 5,58 X3.P$1 X3.P$2
VBUS
  Top 0.406: X3.1 8,48.46 8,46 9,45 F2.2
VBUS_DETECT  (via drill 0.6)
  Top 0.305: U$1.110 59.75,19.75 v61,21 | 22K.2 C21.1 15K.2 62.85,17.85 v63,18
  Bottom 0.305: v63,18 63,19 v61,21
VCC  (via drill 0.6)
  Top 0.305: R4.2 15.15,55.85 16,55 17,55 18,54 18,50 v19,49
  Top 0.406: 24,25 SJ1.2 | 24,25 25,26 25,30 24.5,30.5 C25.+ 20.5,30.5 v20,31 | v20,37 16.41,37 VREG1.3 16.1,38.9 16,39 5,39 4,38 C6.+ | v25,44 25,46.5 C16.+ 23.85,47.65 C18.1 25,51 26,50 | C14.+ 81.5,21 84.22,21 IC4.8 | C14.+ 80,23 | 80,23 81,23 83,25 83,27 82.59,27.41 IC3.12 | 80.96,30 IC3.16 79.15,30.05 78.9,29.8 78.9,29.1 79.27,28.73 IC3.14 | v82,30 80.96,30 | v81,25 80,24 80,23 | C14.+ 79.5,22.5 78.85,21.85 C13.1 79,19.85 v79,18 | 80.96,30 80.96,29.44 IC3.15 | v79,7 79,5.15 R25.2 78.85,2.85 78,2 44.05,2 TX.A RX1.A RX.A 30,1.95 29,2.95 29,20 24,25 | v55,58 56,57 56,55 54.4,53.4 IC1.21 54.4,48.55 C15.1 54,47.85 v54,46 54,44.15 C17.1 | v51,46 45.85,46 R20.2 43.15,46.85 v40,50 | R4.2 15.15,60.12 ICSP.2 12,68.19 12,72 10.27,73.73 ICSP1.2 | VOLUME3.CW 68.54,67.54 | VOLUME3.CW 70.54,70 79.54,70 VOLUME2.CW 83.54,70 93,70 94.54,68.46 VOLUME1.CW | IC2.4 31.6,59.6 v32,60 | v36,50 35,51 32,51 31,52 | VOLUME3.CW 68.54,68.46 67,70 57.54,70 VOLUME4.CW 55,67.46 v55,63 54.4,62.4 IC1.4 | IC1.6 52.8,62.2 51,64 v50,64 | 26,50 v26,49 | 26,50 27,51 30,51 31,52 | IC2.32 28.8,54.2 31,52 | v32,56 32,53 31,52
  Bottom 0.305: v26,49 v19,49
  Bottom 0.406: v20,31 v20,37 24,37 25,38 v25,44 | v82,30 82,26 v81,25 | v79,7 v79,18 | v51,46 v54,46 | v36,50 v40,50 | v55,63 v55,58 50,63 v50,64 | v32,56 v32,60
VOLUME_OUT
  Top 0.406: VOLUME.WIPER 90,37 91,38 91,41 85,47 85,52 82,55 82,59.02 J4-AUDIO.T
VUCAP
  Top 0.305: IC2.27 24.8,54.8 24,54 21,54 20,53 20,42 19,41 C7.2
XTAL1
  Top 0.406: IC2.1 35.2,57.2 36,58 R2.2 36.15,59 Y2.1
XTAL2
  Top 0.406: Y2.3 36.15,61 R2.1 34.85,60.85 34,60 34,59 33,58 IC2.2
XTAL3
  Top 0.305: U$1.36 37.25,43.9 R1.2
  Top 0.406: Y1.1 37,44.15 R1.2
XTAL4
  Top 0.305: U$1.35 37.75,42.9 R1.1
  Top 0.406: Y1.3 39,44.15 R1.1
XTAL5  (via drill 0.6)
  Top 0.406: v42,63 51,63 52,62 IC1.7 | Y3.1 39.85,55 R19.2 41.85,54.85 v42,55
  Bottom 0.406: v42,55 v42,63
XTAL6  (via drill 0.6)
  Top 0.406: Y3.3 36.15,53.15 R19.1 42.15,53.15 v43,54 | IC1.8 51.2,61.8 51,62 v43,62
  Bottom 0.406: v43,54 v43,62
XTAL7
  Top 0.305: R16.2 63,38 61,38 59.75,36.75 U$1.144
  Top 0.406: Y4.1 66.85,37.85 R16.2
XTAL8
  Top 0.305: R16.1 62.9,36.25 U$1.143
  Top 0.406: R16.1 63.15,36 Y4.3